# Altium project MCD.PrjPcb
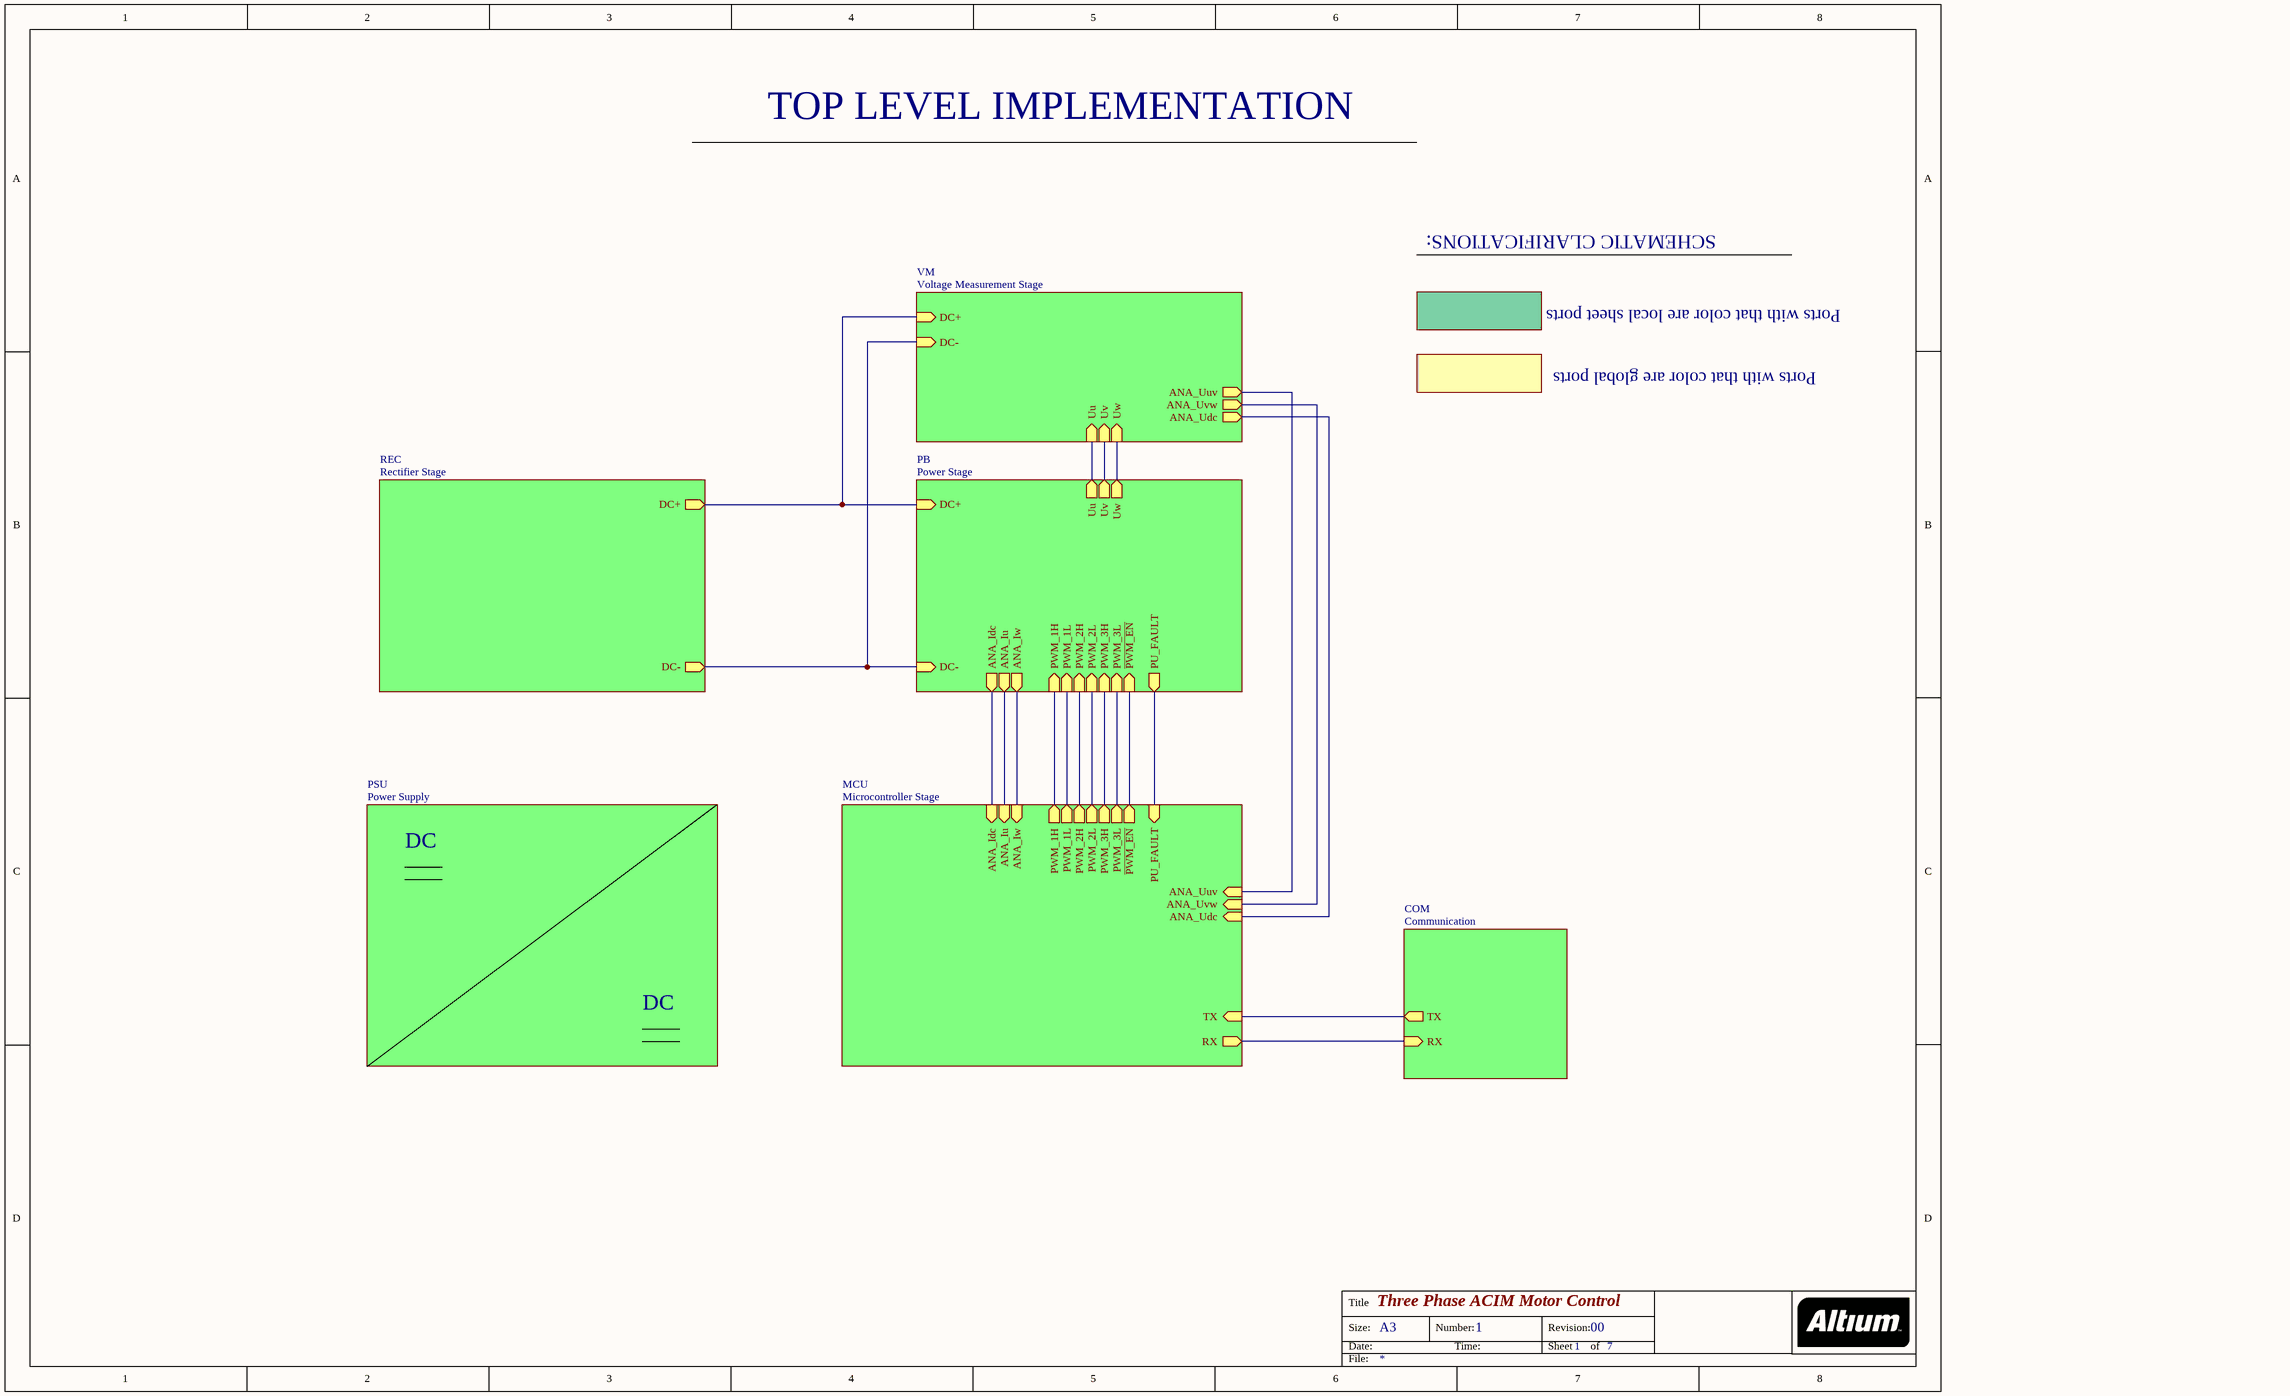
[diagram p0: Main.SchDoc]
7 sheets, 261 parts. Net scope: hierarchical (ports join the sheet entries above them; power ports are global).
Board file: MCD V1.00 R.00.PcbDoc
Sheets:
  Main.SchDoc
    PB = Power Stage.SchDoc
    MCU = Microcontroller Stage.SchDoc
    REC = Rectifier Stage.SchDoc
    VM = Voltage Measurement Stage.SchDoc
    COM = Communication.SchDoc
    PSU = Power Supply.SchDoc

## Sheet Main.SchDoc: Three Phase ACIM Motor Control
size A3; Date: 28.08.2010; ApprovedBy: V.Gyurov; CheckedBy: V.Gyurov; Author: V.Gyurov; CompanyName: V.Gyurov; DrawnBy: V.Gyurov; Engineer: V.Gyurov; DocumentNumber: 1; Revision: 00; SheetNumber: 1; SheetTotal: 7; VersionControl_RevNumber: V1.00 R.00; CurrentDate: 28.08.2010; DocumentName: Three Phase ACIM Motor Control; ModifiedDate: 28.08.2010

### Sub-sheets
COM = Communication: TX (out), RX (in)
MCU = Microcontroller Stage: ANA_Idc (in), ANA_Iu (in), ANA_Iw (in), PWM_1H (out), PWM_1L (out), PWM_2H (out), PWM_2L (out), PWM_3H (out), PWM_3L (out), ~{PWM_EN} (out), PU_FAULT (in), ANA_Uuv (in), ANA_Uvw (in), TX (in), RX (out), ANA_Udc (in)
PB = Power Stage: ANA_Idc (out), PWM_1H (in), PWM_1L (in), PWM_2H (in), PWM_2L (in), PWM_3H (in), PWM_3L (in), ~{PWM_EN} (in), PU_FAULT (out), ANA_Iu (out), ANA_Iw (out), Uu (out), Uv (out), Uw (out), DC+ (in), DC- (in)
PSU = Power Supply: no entries
REC = Rectifier Stage: DC+ (out), DC- (out)
VM = Voltage Measurement Stage: Uu (in), Uv (in), Uw (in), ANA_Uuv (out), ANA_Uvw (out), DC+ (in), DC- (in), ANA_Udc (out)

### Nets
NetC401_2: sheet PB/ANA_Iu, sheet MCU/ANA_Iu
NetC408_2: sheet PB/DC+, sheet REC/DC+, sheet VM/DC+
NetC413_2: sheet PB/ANA_Iw, sheet MCU/ANA_Iw
NetC421_2: sheet PB/ANA_Idc, sheet MCU/ANA_Idc
NetC435_2: sheet PB/Uw, sheet VM/Uw
NetC436_2: sheet PB/Uv, sheet VM/Uv
NetC437_2: sheet PB/Uu, sheet VM/Uu
NetC601_2: sheet MCU/ANA_Udc, sheet VM/ANA_Udc
NetC605_2: sheet MCU/ANA_Uuv, sheet VM/ANA_Uuv
NetC609_2: sheet MCU/ANA_Uvw, sheet VM/ANA_Uvw
NetC700_2: sheet PB/DC-, sheet REC/DC-, sheet VM/DC-
NetR303_2: sheet PB/PU_FAULT, sheet MCU/PU_FAULT
NetU100_1: sheet MCU/TX, sheet COM/TX
NetU100_5: sheet MCU/RX, sheet COM/RX
NetU300_3: sheet PB/~{PWM_EN}, sheet MCU/~{PWM_EN}
NetU301_1: sheet PB/PWM_3H, sheet MCU/PWM_3H
NetU301_60: sheet PB/PWM_1L, sheet MCU/PWM_1L
NetU301_61: sheet PB/PWM_1H, sheet MCU/PWM_1H
NetU301_62: sheet PB/PWM_2L, sheet MCU/PWM_2L
NetU301_63: sheet PB/PWM_2H, sheet MCU/PWM_2H
NetU301_64: sheet PB/PWM_3L, sheet MCU/PWM_3L

### Notes on the sheet
- TOP LEVEL IMPLEMENTATION
- SCHEMATIC CLARIFICATIONS:
- Ports with that color are local sheet ports
- Ports with that color are global ports
- DC
- Title
- Size:
- Date:
- A3
- Number:
- Time:
- Revision:
- Sheet
- of
- File:

## Sheet Power Stage.SchDoc: Power Unit Stage
size A3; Date: 28.08.2010; ApprovedBy: V.Gyurov; CheckedBy: V.Gyurov; Author: V.Gyurov; CompanyName: V.Gyurov; DrawnBy: V.Gyurov; Engineer: V.Gyurov; DocumentNumber: 2; Revision: 00; SheetNumber: 2; SheetTotal: 7; VersionControl_RevNumber: V1.00 R.00; CurrentDate: 28.08.2010; DocumentName: Power Unit Stage; ModifiedDate: 28.08.2010
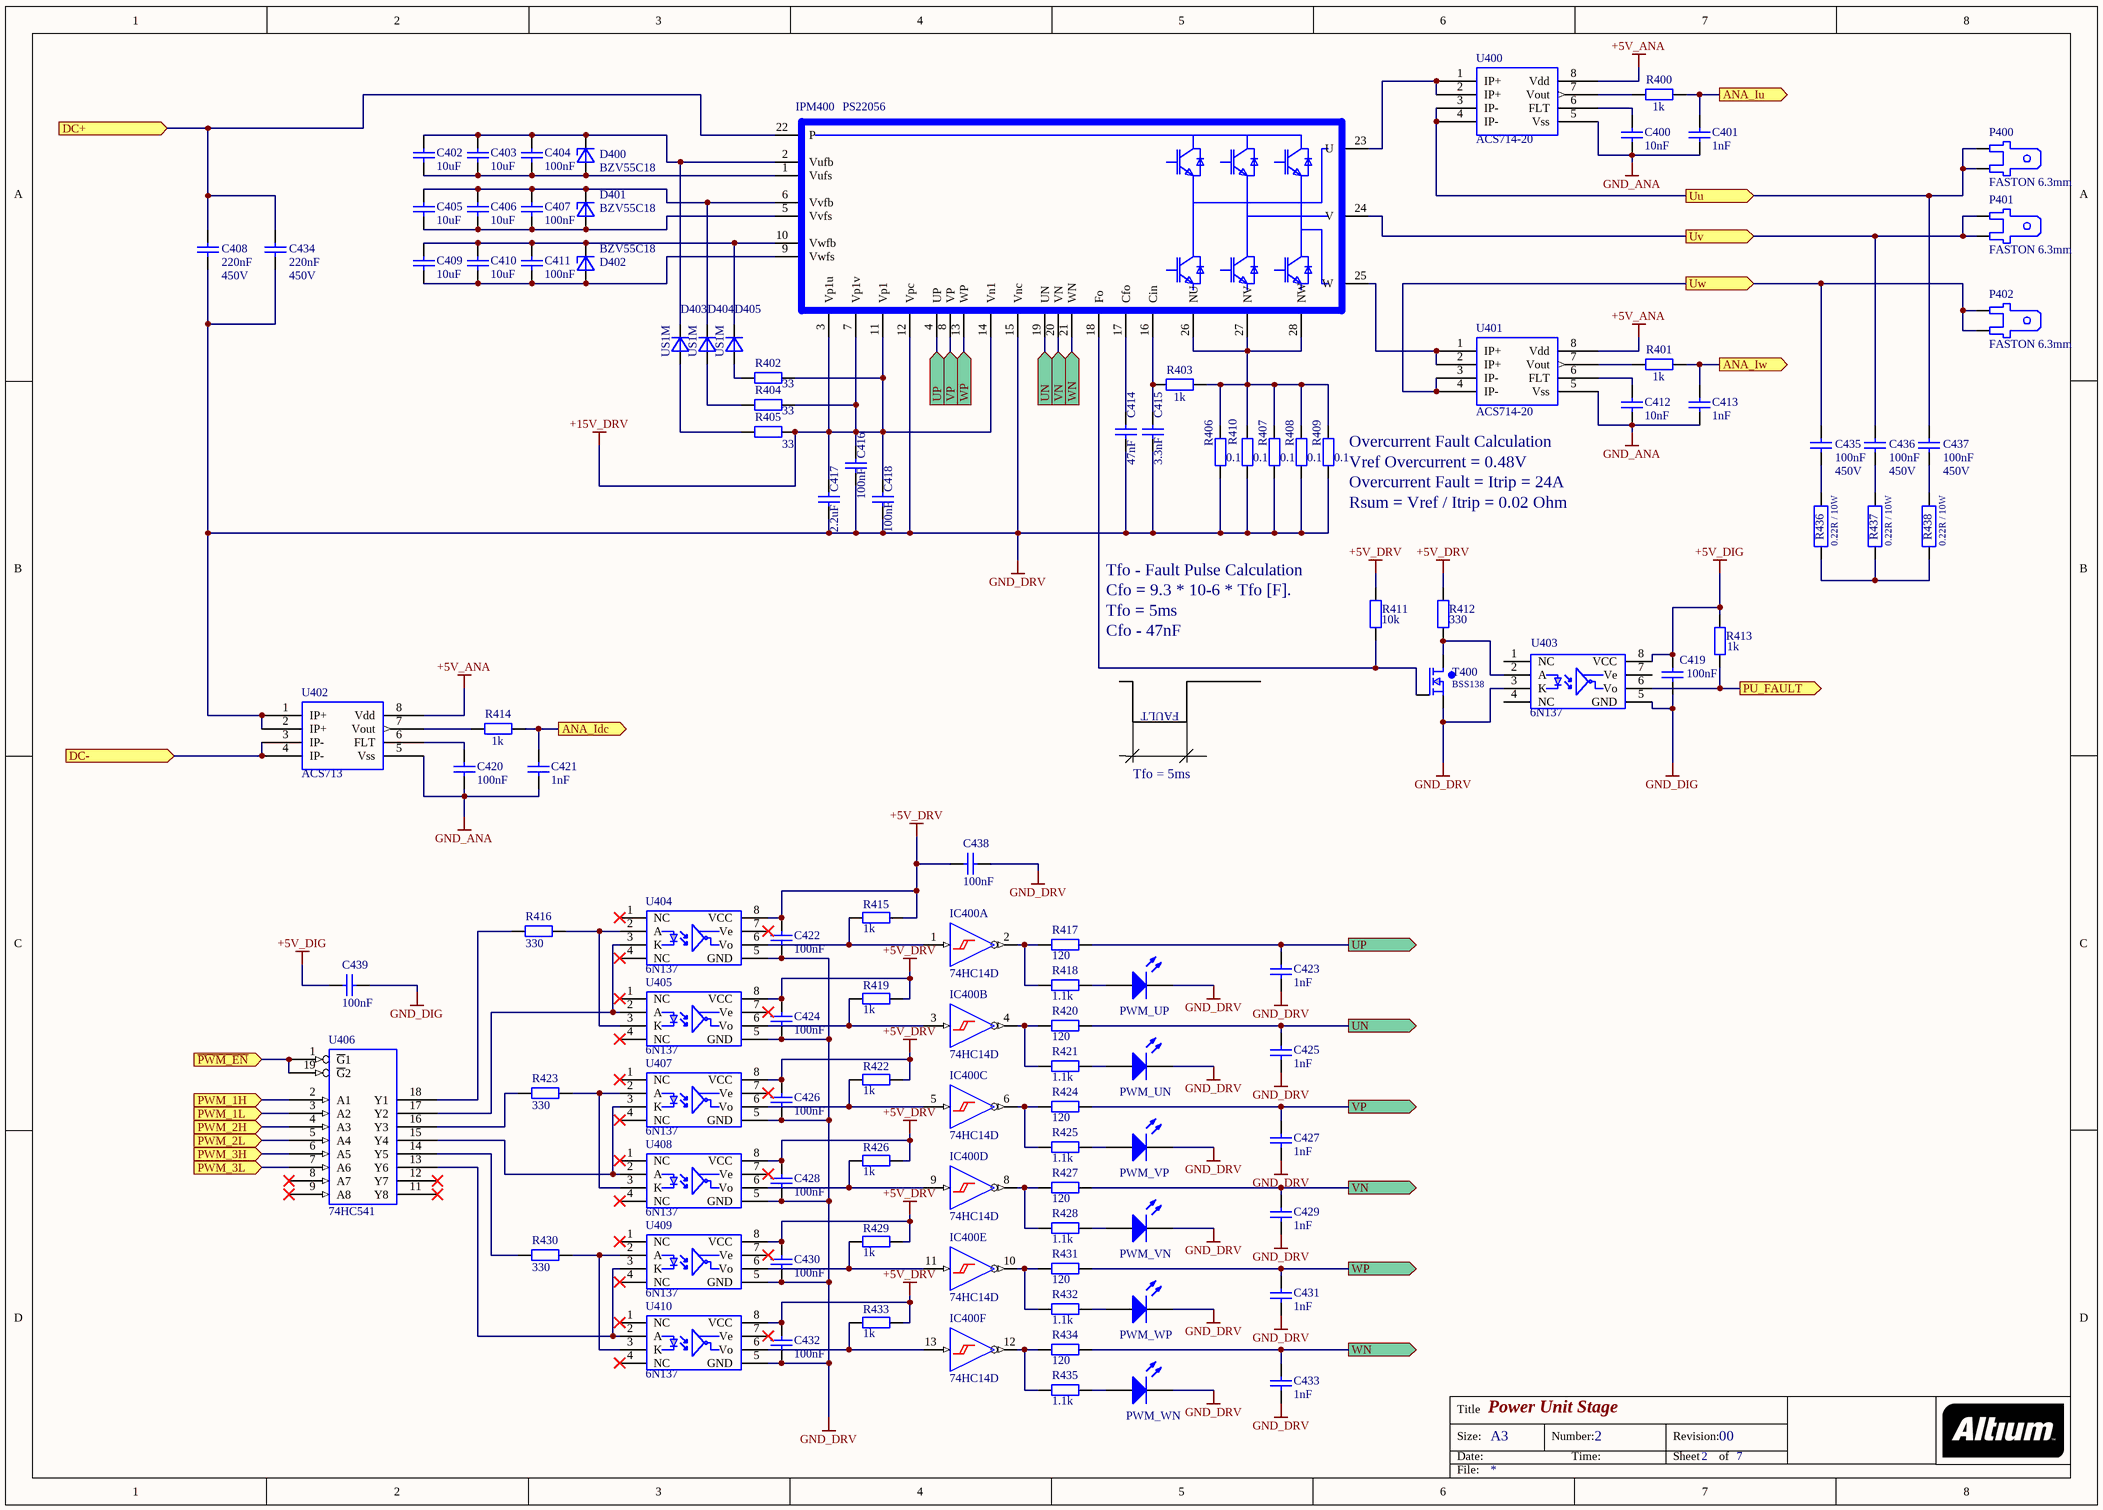
[diagram p1: Power Stage.SchDoc]

### Parts
C400  value 10nF  [1206_REFLOW]  (hidden comment: Cap 1206)
C401  value 1nF  [1206_REFLOW]  (hidden comment: Cap 1206)
C402  value 10uF  [1206_REFLOW]  (hidden comment: Cap 1206)
C403  value 10uF  [1206_REFLOW]  (hidden comment: Cap 1206)
C404  value 100nF  [1206_REFLOW]  (hidden comment: Cap 1206)
C405  value 10uF  [1206_REFLOW]  (hidden comment: Cap 1206)
C406  value 10uF  [1206_REFLOW]  (hidden comment: Cap 1206)
C407  value 100nF  [1206_REFLOW]  (hidden comment: Cap 1206)
C408  value 220nF  Voltage: 450V  [CAP26X19P22_5H]  (hidden comment: Cap)
C409  value 10uF  [1206_REFLOW]  (hidden comment: Cap 1206)
C410  value 10uF  [1206_REFLOW]  (hidden comment: Cap 1206)
C411  value 100nF  [1206_REFLOW]  (hidden comment: Cap 1206)
C412  value 10nF  [1206_REFLOW]  (hidden comment: Cap 1206)
C413  value 1nF  [1206_REFLOW]  (hidden comment: Cap 1206)
C414  value 47nF  [1206_REFLOW]  (hidden comment: Cap 1206)
C415  value 3.3nF  [1206_REFLOW]  (hidden comment: Cap 1206)
C416  value 100nF  [1206_REFLOW]  (hidden comment: Cap 1206)
C417  value 2.2uF  [1206_REFLOW]  (hidden comment: Cap 1206)
C418  value 100nF  [1206_REFLOW]  (hidden comment: Cap 1206)
C419  value 100nF  [1206_REFLOW]  (hidden comment: Cap 1206)
C420  value 100nF  [1206_REFLOW]  (hidden comment: Cap 1206)
C421  value 1nF  [1206_REFLOW]  (hidden comment: Cap 1206)
C422  value 100nF  [1206_REFLOW]  (hidden comment: Cap 1206)
C423  value 1nF  [1206_REFLOW]  (hidden comment: Cap 1206)
C424  value 100nF  [1206_REFLOW]  (hidden comment: Cap 1206)
C425  value 1nF  [1206_REFLOW]  (hidden comment: Cap 1206)
C426  value 100nF  [1206_REFLOW]  (hidden comment: Cap 1206)
C427  value 1nF  [1206_REFLOW]  (hidden comment: Cap 1206)
C428  value 100nF  [1206_REFLOW]  (hidden comment: Cap 1206)
C429  value 1nF  [1206_REFLOW]  (hidden comment: Cap 1206)
C430  value 100nF  [1206_REFLOW]  (hidden comment: Cap 1206)
C431  value 1nF  [1206_REFLOW]  (hidden comment: Cap 1206)
C432  value 100nF  [1206_REFLOW]  (hidden comment: Cap 1206)
C433  value 1nF  [1206_REFLOW]  (hidden comment: Cap 1206)
C434  value 220nF  Voltage: 450V  [CAP26X19P22_5H]  (hidden comment: Cap)
C435  value 100nF  Voltage: 450V  [CAP26X19P22_5H]  (hidden comment: Cap)
C436  value 100nF  Voltage: 450V  [CAP26X19P22_5H]  (hidden comment: Cap)
C437  value 100nF  Voltage: 450V  [CAP26X19P22_5H]  (hidden comment: Cap)
C438  value 100nF  [1206_REFLOW]  (hidden comment: Cap 1206)
C439  value 100nF  [1206_REFLOW]  (hidden comment: Cap 1206)
D400  value BZV55C18  [D_MINIMELF_BZV55C5V1(Primary)]  (hidden comment: BZV55CXXX)
D401  value BZV55C18  [D_MINIMELF_BZV55C5V1(Primary)]  (hidden comment: BZV55CXXX)
D402  value BZV55C18  [D_MINIMELF_BZV55C5V1(Primary)]  (hidden comment: BZV55CXXX)
D403  US1M  [DO-214_S1A(Primary)]
D404  value US1M  [DO-214_S1A(Primary)]  (hidden comment: S1A)
D405  value US1M  [DO-214_S1A(Primary)]  (hidden comment: S1A)
IC400  value 74HC14D  [SO14_HIS]  (hidden comment: SN74HC14D)  (parts A,B,C,D,E,F of 6)
IPM400  value PS22056  [PS22054]  (hidden comment: Component_1)
P400  FASTON 6.3MM  [FASTON 6.3mm]
P401  FASTON 6.3MM  [FASTON 6.3mm]
P402  FASTON 6.3MM  [FASTON 6.3mm]
PWM_UN  LED  [LED_1206]  (value not drawn)
PWM_UP  LED  [LED_1206]  (value not drawn)
PWM_VN  LED  [LED_1206]  (value not drawn)
PWM_VP  LED  [LED_1206]  (value not drawn)
PWM_WN  LED  [LED_1206]  (value not drawn)
PWM_WP  LED  [LED_1206]  (value not drawn)
R400  value 1k  [1206_REFLOW]  (hidden comment: RES)
R401  value 1k  [1206_REFLOW]  (hidden comment: RES)
R402  value 33  [1206_REFLOW]  (hidden comment: RES)
R403  value 1k  [1206_REFLOW]  (hidden comment: RES)
R404  value 33  [1206_REFLOW]  (hidden comment: RES)
R405  value 33  [1206_REFLOW]  (hidden comment: RES)
R406  value 0.1  [1206_REFLOW]  (hidden comment: RES)
R407  value 0.1  [1206_REFLOW]  (hidden comment: RES)
R408  value 0.1  [1206_REFLOW]  (hidden comment: RES)
R409  value 0.1  [1206_REFLOW]  (hidden comment: RES)
R410  value 0.1  [1206_REFLOW]  (hidden comment: RES)
R411  value 10k  [1206_REFLOW]  (hidden comment: RES)
R412  value 330  [1206_REFLOW]  (hidden comment: RES)
R413  value 1k  [1206_REFLOW]  (hidden comment: RES)
R414  value 1k  [1206_REFLOW]  (hidden comment: RES)
R415  value 1k  [1206_REFLOW]  (hidden comment: RES)
R416  value 330  [1206_REFLOW]  (hidden comment: RES)
R417  value 120  [1206_REFLOW]  (hidden comment: RES)
R418  value 1.1k  [1206_REFLOW]  (hidden comment: RES)
R419  value 1k  [1206_REFLOW]  (hidden comment: RES)
R420  value 120  [1206_REFLOW]  (hidden comment: RES)
R421  value 1.1k  [1206_REFLOW]  (hidden comment: RES)
R422  value 1k  [1206_REFLOW]  (hidden comment: RES)
R423  value 330  [1206_REFLOW]  (hidden comment: RES)
R424  value 120  [1206_REFLOW]  (hidden comment: RES)
R425  value 1.1k  [1206_REFLOW]  (hidden comment: RES)
R426  value 1k  [1206_REFLOW]  (hidden comment: RES)
R427  value 120  [1206_REFLOW]  (hidden comment: RES)
R428  value 1.1k  [1206_REFLOW]  (hidden comment: RES)
R429  value 1k  [1206_REFLOW]  (hidden comment: RES)
R430  value 330  [1206_REFLOW]  (hidden comment: RES)
R431  value 120  [1206_REFLOW]  (hidden comment: RES)
R432  value 1.1k  [1206_REFLOW]  (hidden comment: RES)
R433  value 1k  [1206_REFLOW]  (hidden comment: RES)
R434  value 120  [1206_REFLOW]  (hidden comment: RES)
R435  value 1.1k  [1206_REFLOW]  (hidden comment: RES)
R436  value 0.22R / 10W  [RES 10W]  (hidden comment: RES 10W)
R437  value 0.22R / 10W  [RES 10W]  (hidden comment: RES 10W)
R438  value 0.22R / 10W  [RES 10W]  (hidden comment: RES 10W)
T400  value BSS138  [SOT23_HIS_Primary]  (hidden comment: MOSFET N SOT23)
U400  value ACS714-20  [SO8]  (hidden comment: ACS714)
U401  value ACS714-20  [SO8]  (hidden comment: ACS714)
U402  ACS713  [SO8]
U403  6N137  [SO8_HIS]
U404  6N137  [SO8_HIS]
U405  6N137  [SO8_HIS]
U406  74HC541  [SOL20]
U407  6N137  [SO8_HIS]
U408  6N137  [SO8_HIS]
U409  6N137  [SO8_HIS]
U410  6N137  [SO8_HIS]

### Ports
ANA_Idc (out), ANA_Iu (out), ANA_Iw (out), DC+ (in), DC- (in), PU_FAULT (out), PWM_1H (in), PWM_1L (in), PWM_2H (in), PWM_2L (in), PWM_3H (in), PWM_3L (in), UN (in), UN (out), UP (in), UP (out), Uu (out), Uv (out), Uw (out), VN (in), VN (out), VP (in), VP (out), WN (in), WN (out), WP (in), WP (out), ~{PWM_EN} (in)

### Nets
+5V_ANA: U400.8(Vdd) U401.8(Vdd) U402.8(Vdd)
+5V_DIG: C419.2 C439.2 R413.2 U403.8(VCC) U406.20(VCC)
+5V_DRV: C422.2 C424.2 C426.2 C428.2 C430.2 C432.2 C438.2 IC400.14(VCC) R411.2 R412.2 R415.2 R419.2 R422.2 R426.2 R429.2 R433.2 U404.8(VCC) U405.8(VCC) U407.8(VCC) U408.8(VCC) U409.8(VCC) U410.8(VCC)
+15V_DRV: C416.2 C417.2 C418.2 IPM400.3(Vp1u) IPM400.7(Vp1v) IPM400.11(Vp1) IPM400.14(Vn1) R402.2 R404.2 R405.2
GND_ANA: C400.1 C401.1 C412.1 C413.1 C420.1 C421.1 U400.5(Vss) U401.5(Vss) U402.5(Vss)
GND_DIG: C419.1 C439.1 U403.5(GND) U406.10(GND)
GND_DRV: C408.1 C414.1 C415.1 C416.1 C417.1 C418.1 C422.1 C423.1 C424.1 C425.1 C426.1 C427.1 C428.1 C429.1 C430.1 C431.1 C432.1 C433.1 C434.1 C438.1 IC400.7(GND) IPM400.12(Vpc) IPM400.15(Vnc) PWM_UN.K PWM_UP.K PWM_VN.K PWM_VP.K PWM_WN.K PWM_WP.K R406.1 R407.1 R408.1 R409.1 R410.1 T400.2(S) U402.1(IP+) U402.2(IP+) U403.3(K) U404.5(GND) U405.5(GND) U407.5(GND) U408.5(GND) U409.5(GND) U410.5(GND)
NetC400_2: C400.2 U400.6(FLT)
NetC401_2: C401.2 R400.2 ; port ANA_Iu
NetC402_1: C402.1 C403.1 C404.1 D400.A IPM400.1(Vufs)
NetC402_2: C402.2 C403.2 C404.2 D400.K D403.K IPM400.2(Vufb)
NetC405_1: C405.1 C406.1 C407.1 D401.A IPM400.5(Vvfs)
NetC405_2: C405.2 C406.2 C407.2 D401.K D404.K IPM400.6(Vvfb)
NetC408_2: C408.2 C434.2 IPM400.22(P) ; port DC+
NetC409_1: C409.1 C410.1 C411.1 D402.A IPM400.9(Vwfs)
NetC409_2: C409.2 C410.2 C411.2 D402.K D405.K IPM400.10(Vwfb)
NetC412_2: C412.2 U401.6(FLT)
NetC413_2: C413.2 R401.2 ; port ANA_Iw
NetC414_2: C414.2 IPM400.17(Cfo)
NetC415_2: C415.2 IPM400.16(Cin) R403.1
NetC420_2: C420.2 U402.6(FLT)
NetC421_2: C421.2 R414.2 ; port ANA_Idc
NetC423_2: C423.2 IPM400.4(UP) R417.2 ; port UP
NetC425_2: C425.2 IPM400.19(UN) R420.2 ; port UN
NetC427_2: C427.2 IPM400.8(VP) R424.2 ; port VP
NetC429_2: C429.2 IPM400.20(VN) R427.2 ; port VN
NetC431_2: C431.2 IPM400.13(WP) R431.2 ; port WP
NetC433_2: C433.2 IPM400.21(WN) R434.2 ; port WN
NetC435_1: C435.1 R436.1
NetC435_2: C435.2 P402.1 P402.2 U401.3(IP-) U401.4(IP-) ; port Uw
NetC436_1: C436.1 R437.1
NetC436_2: C436.2 IPM400.24(V) P401.1 P401.2 ; port Uv
NetC437_1: C437.1 R438.1
NetC437_2: C437.2 P400.1 P400.2 U400.3(IP-) U400.4(IP-) ; port Uu
NetC700_2: U402.3(IP-) U402.4(IP-) ; port DC-
NetD403_A: D403.A R405.1
NetD404_A: D404.A R404.1
NetD405_A: D405.A R402.1
NetIC400_1: IC400.1(A) R415.1 U404.6(Vo)
NetIC400_2: IC400.2(Y) R417.1 R418.1
NetIC400_3: IC400.3(A) R419.1 U405.6(Vo)
NetIC400_4: IC400.4(Y) R420.1 R421.1
NetIC400_5: IC400.5(A) R422.1 U407.6(Vo)
NetIC400_6: IC400.6(Y) R424.1 R425.1
NetIC400_8: IC400.8(Y) R427.1 R428.1
NetIC400_9: IC400.9(A) R426.1 U408.6(Vo)
NetIC400_10: IC400.10(Y) R431.1 R432.1
NetIC400_11: IC400.11(A) R429.1 U409.6(Vo)
NetIC400_12: IC400.12(Y) R434.1 R435.1
NetIC400_13: IC400.13(A) R433.1 U410.6(Vo)
NetIPM400_18: IPM400.18(Fo) R411.1 T400.1(G)
NetIPM400_23: IPM400.23(U) U400.1(IP+) U400.2(IP+)
NetIPM400_25: IPM400.25(W) U401.1(IP+) U401.2(IP+)
NetIPM400_26: IPM400.26(NU) IPM400.27(NV) IPM400.28(NW) R403.2 R406.2 R407.2 R408.2 R409.2 R410.2
NetPWM_UN_A: PWM_UN.A R421.2
NetPWM_UP_A: PWM_UP.A R418.2
NetPWM_VN_A: PWM_VN.A R428.2
NetPWM_VP_A: PWM_VP.A R425.2
NetPWM_WN_A: PWM_WN.A R435.2
NetPWM_WP_A: PWM_WP.A R432.2
NetR303_2: R413.1 U403.6(Vo) ; port PU_FAULT
NetR400_1: R400.1 U400.7(Vout)
NetR401_1: R401.1 U401.7(Vout)
NetR412_1: R412.1 T400.3(D) U403.2(A)
NetR414_1: R414.1 U402.7(Vout)
NetR416_1: R416.1 U406.18(Y1)
NetR416_2: R416.2 U404.2(A) U405.3(K)
NetR423_1: R423.1 U406.16(Y3)
NetR423_2: R423.2 U407.2(A) U408.3(K)
NetR430_1: R430.1 U406.14(Y5)
NetR430_2: R430.2 U409.2(A) U410.3(K)
NetR436_2: R436.2 R437.2 R438.2
NetU300_3: U406.1(~{G}1) U406.19(~{G}2) ; port ~{PWM_EN}
NetU301_1: U406.6(A5) ; port PWM_3H
NetU301_60: U406.3(A2) ; port PWM_1L
NetU301_61: U406.2(A1) ; port PWM_1H
NetU301_62: U406.5(A4) ; port PWM_2L
NetU301_63: U406.4(A3) ; port PWM_2H
NetU301_64: U406.7(A6) ; port PWM_3L
NetU404_3: U404.3(K) U405.2(A) U406.17(Y2)
NetU406_13: U406.13(Y6) U409.3(K) U410.2(A)
NetU406_15: U406.15(Y4) U407.3(K) U408.2(A)

Not connected (* = marked no-connect by the designer): U403 1(NC) 4(NC) 7(Ve); U404 1(NC)* 4(NC)* 7(Ve)*; U405 1(NC)* 4(NC)* 7(Ve)*; U406 8(A7)* 9(A8)* 11(Y8)* 12(Y7)*; U407 1(NC)* 4(NC)* 7(Ve)*; U408 1(NC)* 4(NC)* 7(Ve)*; U409 1(NC)* 4(NC)* 7(Ve)*; U410 1(NC)* 4(NC)* 7(Ve)*

### Notes on the sheet
- (near R409) Overcurrent Fault Calculation
- (near R409) Overcurrent Fault = Itrip = 24A
- (near R409) Vref Overcurrent = 0.48V
- Rsum = Vref / Itrip = 0.02 Ohm
- (near R411) Tfo - Fault Pulse Calculation
- (near R411) Cfo = 9.3 * 10-6 * Tfo [F].
- Tfo = 5ms
- Cfo - 47nF
- FAULT
- Title
- Size:
- Date:
- A3
- Number:
- Time:
- Revision:
- Sheet
- of
- File:

### Library data of the parts
D400-D402 = BZV55CXXX: Zener Diode
D403 = S1A: Value: US1M
IC400 = SN74HC14D: Hex Schmitt-Trigger INVERTERS; Group: IC; Subgroup: Logic; Subgroup1: Gate; Package: SO14; Mounting: SMD
IPM400 = Component_1: Description: IPM Module
PWM_UN PWM_UP PWM_VN PWM_VP PWM_WN PWM_WP = LED: Value: TBD
R400-R435 = RES 1
U403-U405 U407-U410 = 6N137: Single Optocoupler; Manufacturer: Agilent; Value: 6N137
P400-P402 = FASTON 6.3MM: Value: FASTON 6.3mm
U402 = ACS713: Value: ACS713
U406 = 74HC541: Value: 74HC541

## Sheet Microcontroller Stage.SchDoc: Microcontroller Stage
size A3; Date: 28.04.2010; ApprovedBy: V.Gyurov; CheckedBy: V.Gyurov; Author: V.Gyurov; CompanyName: V.Gyurov; DrawnBy: V.Gyurov; Engineer: V.Gyurov; Organization: none; DocumentNumber: 5; Revision: 00; SheetNumber: 5; SheetTotal: 7; VersionControl_RevNumber: V1.00 R.00; IsUserConfigurable: none; CurrentDate: 28.04.2010; DocumentName: Microcontroller Stage; ModifiedDate: 28.04.2010
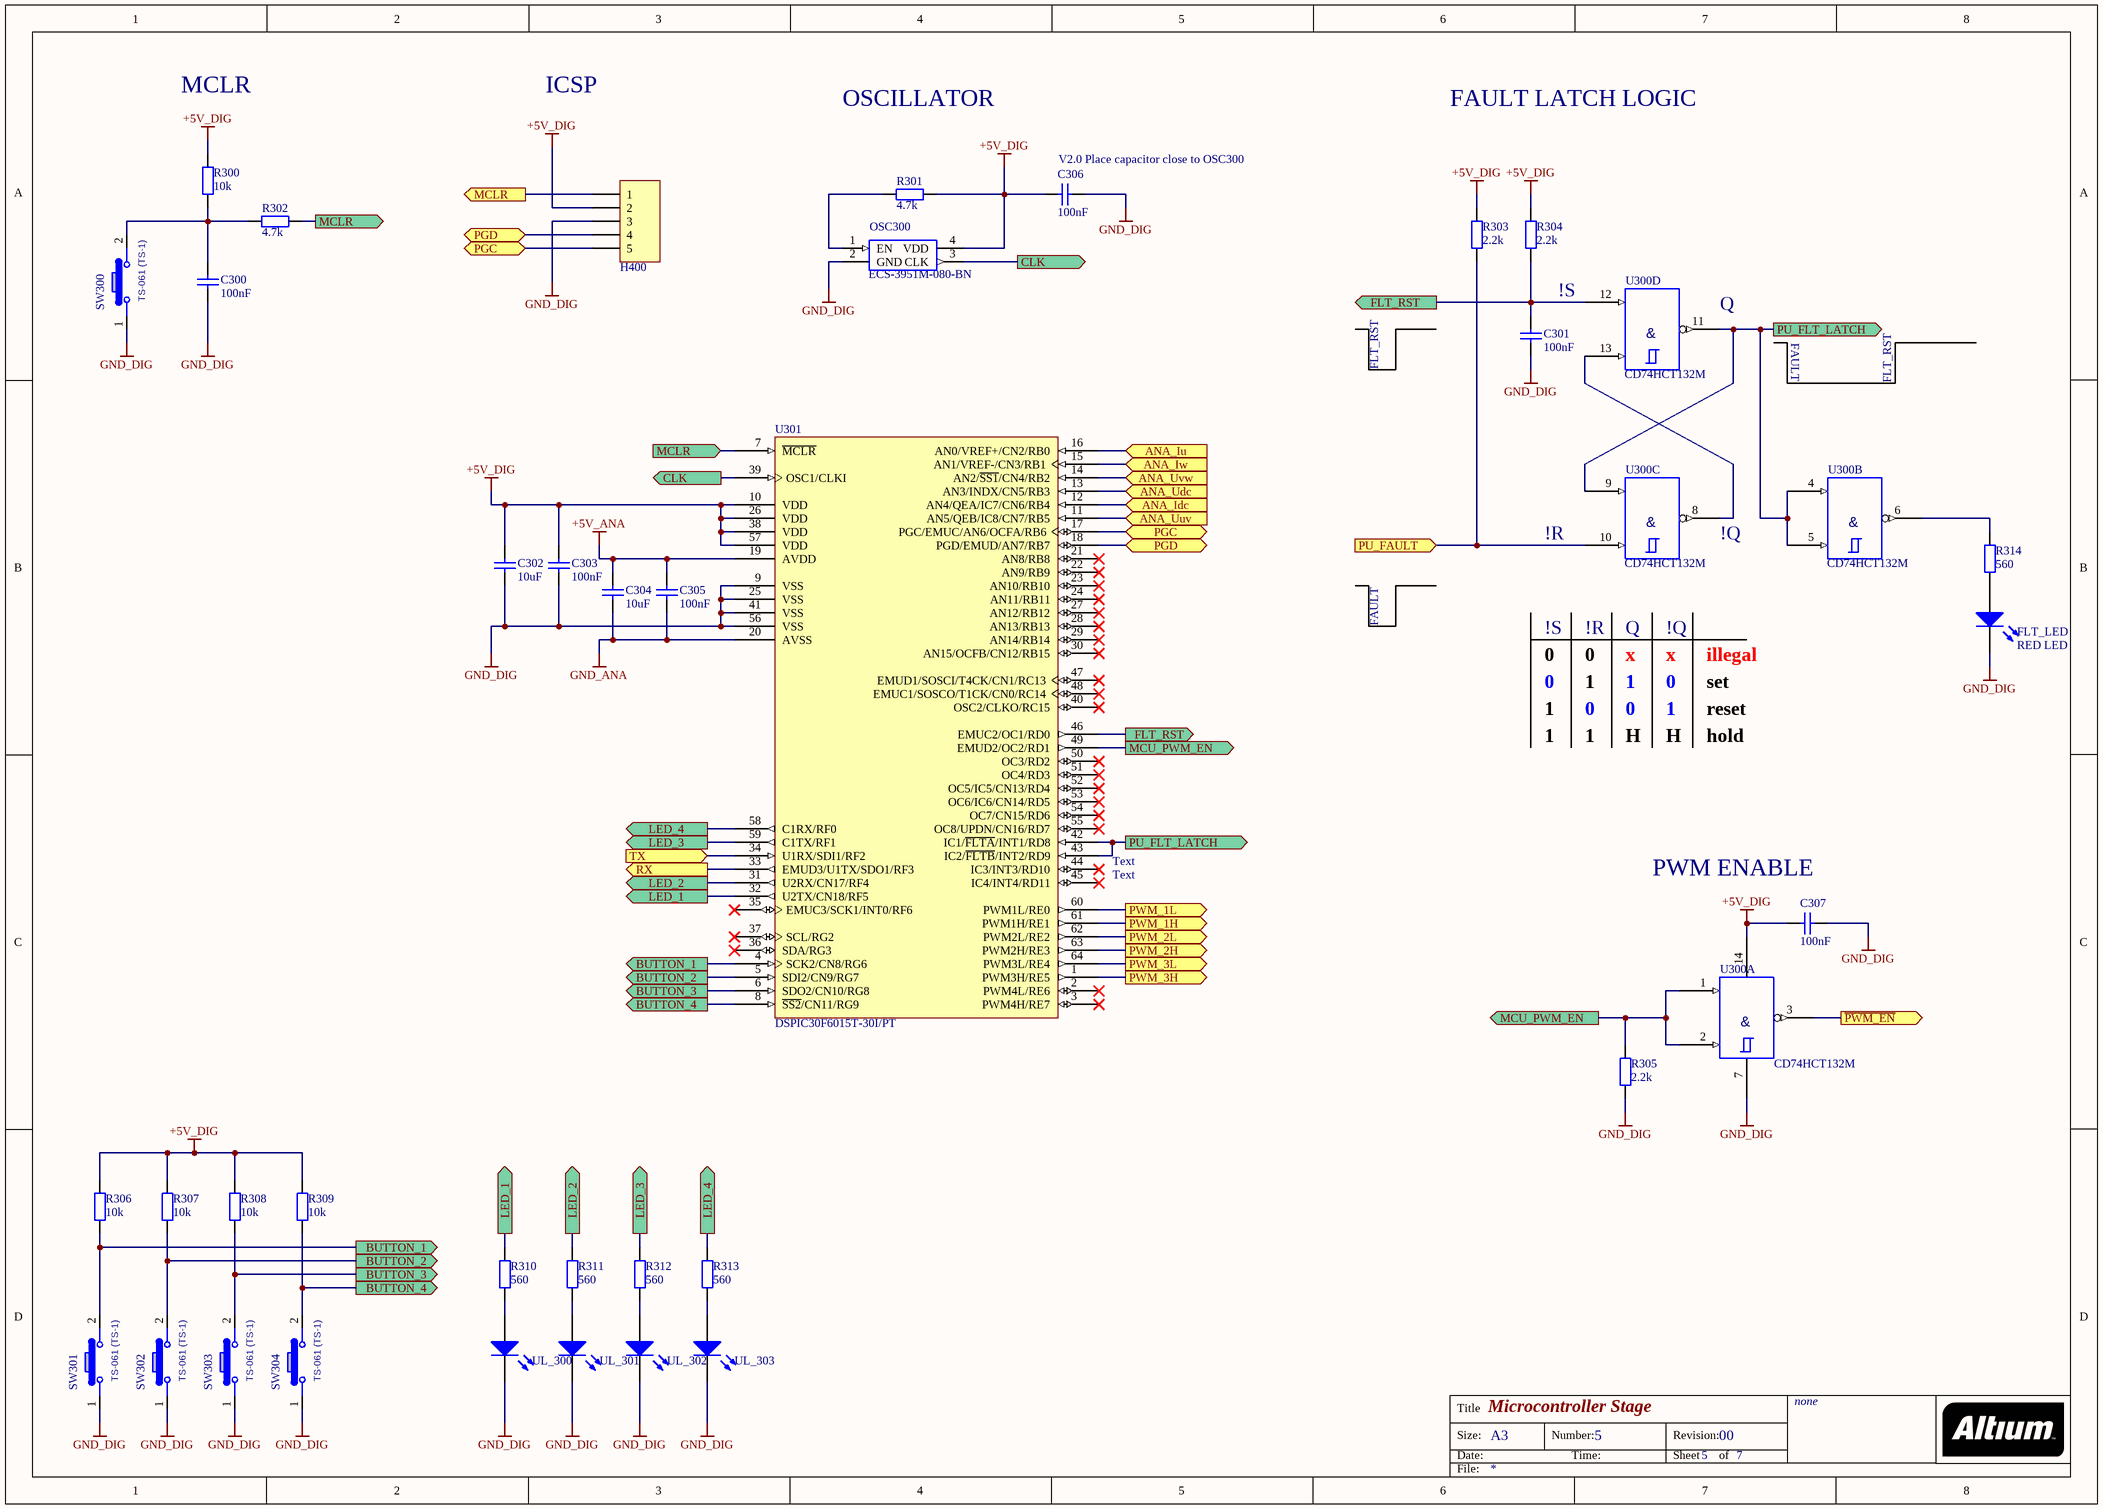
[diagram p2: Microcontroller Stage.SchDoc]

### Parts
C300  value 100nF  [1206_REFLOW]  (hidden comment: Cap 1206)
C301  value 100nF  [1206_REFLOW]  (hidden comment: Cap 1206)
C302  value 10uF  [1206_REFLOW]  (hidden comment: Cap 1206)
C303  value 100nF  [1206_REFLOW]  (hidden comment: Cap 1206)
C304  value 10uF  [1206_REFLOW]  (hidden comment: Cap 1206)
C305  value 100nF  [1206_REFLOW]  (hidden comment: Cap 1206)
C306  value 100nF  [1206_REFLOW]  (hidden comment: Cap 1206)
C307  value 100nF  [1206_REFLOW]  (hidden comment: Cap 1206)
FLT_LED  RED LED  [LED_1206]
H400  HEADER X5  [SIP5]  (value not drawn)
OSC300  value ECS-3951M-080-BN  [OSC7X5]  (hidden comment: ESC-3951M-80-BN)
R300  value 10k  [1206_REFLOW]  (hidden comment: RES)
R301  value 4.7k  [1206_REFLOW]  (hidden comment: RES)
R302  value 4.7k  [1206_REFLOW]  (hidden comment: RES)
R303  value 2.2k  [1206_REFLOW]  (hidden comment: RES)
R304  value 2.2k  [1206_REFLOW]  (hidden comment: RES)
R305  value 2.2k  [1206_REFLOW]  (hidden comment: RES)
R306  value 10k  [1206_REFLOW]  (hidden comment: RES)
R307  value 10k  [1206_REFLOW]  (hidden comment: RES)
R308  value 10k  [1206_REFLOW]  (hidden comment: RES)
R309  value 10k  [1206_REFLOW]  (hidden comment: RES)
R310  value 560  [1206_REFLOW]  (hidden comment: RES)
R311  value 560  [1206_REFLOW]  (hidden comment: RES)
R312  value 560  [1206_REFLOW]  (hidden comment: RES)
R313  value 560  [1206_REFLOW]  (hidden comment: RES)
R314  value 560  [1206_REFLOW]  (hidden comment: RES)
SW300  TS-061 (TS-1)  [BUTTON]
SW301  TS-061 (TS-1)  [BUTTON]
SW302  TS-061 (TS-1)  [BUTTON]
SW303  TS-061 (TS-1)  [BUTTON]
SW304  TS-061 (TS-1)  [BUTTON]
U300  CD74HCT132M  [SO14]  (parts A,B,C,D of 4)
U301  DSPIC30F6015T-30I/PT  [TQFP-PT64_N]
UL_300  YELLOW LED  [LED_1206]  (value not drawn)
UL_301  YELLOW LED  [LED_1206]  (value not drawn)
UL_302  YELLOW LED  [LED_1206]  (value not drawn)
UL_303  YELLOW LED  [LED_1206]  (value not drawn)

### Ports
ANA_Idc (in), ANA_Iu (in), ANA_Iw (in), ANA_Udc (in), ANA_Uuv (in), ANA_Uvw (in), BUTTON_1 (out), BUTTON_2 (out), BUTTON_3 (out), BUTTON_4 (out), CLK (out), FLT_RST (out), LED_1 (out), LED_2 (out), LED_3 (out), LED_4 (out), MCLR (in), MCLR (out), MCU_PWM_EN (out), PGC (bidir), PGD (bidir), PU_FAULT (in), PU_FLT_LATCH (out), PWM_1H (out), PWM_1L (out), PWM_2H (out), PWM_2L (out), PWM_3H (out), PWM_3L (out), RX (out), TX (in), ~{PWM_EN} (out)

### Nets
+5V_ANA: C304.2 C305.2 U301.19(AVDD)
+5V_DIG: C302.2 C303.2 C306.1 C307.2 H400.2 OSC300.4(VDD) R300.1 R301.1 R303.1 R304.1 R306.1 R307.1 R308.1 R309.1 U300.14(Vcc) U301.10(VDD) U301.26(VDD) U301.38(VDD) U301.57(VDD)
GND_ANA: C304.1 C305.1 U301.20(AVSS)
GND_DIG: C300.1 C301.1 C302.1 C303.1 C306.2 C307.1 FLT_LED.K H400.3 OSC300.2(GND) R305.2 SW300.1 SW301.1 SW302.1 SW303.1 SW304.1 U300.7(GND) U301.9(VSS) U301.25(VSS) U301.41(VSS) U301.56(VSS) UL_300.K UL_301.K UL_302.K UL_303.K
NetC300_2: C300.2 R300.2 R302.1 SW300.2
NetC301_2: C301.2 R304.2 U300.12(4A) U301.46(EMUC2/OC1/RD0) ; port FLT_RST
NetC401_2: U301.16(AN0/VREF+/CN2/RB0) ; port ANA_Iu
NetC413_2: U301.15(AN1/VREF-/CN3/RB1) ; port ANA_Iw
NetC421_2: U301.12(AN4/QEA/IC7/CN6/RB4) ; port ANA_Idc
NetC601_2: U301.13(AN3/INDX/CN5/RB3) ; port ANA_Udc
NetC605_2: U301.11(AN5/QEB/IC8/CN7/RB5) ; port ANA_Uuv
NetC609_2: U301.14(AN2/~{SS1}/CN4/RB2) ; port ANA_Uvw
NetFLT_LED_A: FLT_LED.A R314.1
NetH400_1: H400.1 R302.2 U301.7(~{MCLR}) ; port MCLR
NetH400_4: H400.4 U301.18(PGD/EMUD/AN7/RB7) ; port PGD
NetH400_5: H400.5 U301.17(PGC/EMUC/AN6/OCFA/RB6) ; port PGC
NetOSC300_1: OSC300.1(EN) R301.2
NetOSC300_3: OSC300.3(CLK) U301.39(OSC1/CLKI) ; port CLK
NetR303_2: R303.2 U300.10(3B) ; port PU_FAULT
NetR305_1: R305.1 U300.1(1A) U300.2(1B) U301.49(EMUD2/OC2/RD1) ; port MCU_PWM_EN
NetR306_2: R306.2 SW301.2 U301.4(SCK2/CN8/RG6) ; port BUTTON_1
NetR307_2: R307.2 SW302.2 U301.5(SDI2/CN9/RG7) ; port BUTTON_2
NetR308_2: R308.2 SW303.2 U301.6(SDO2/CN10/RG8) ; port BUTTON_3
NetR309_2: R309.2 SW304.2 U301.8(~{SS2}/CN11/RG9) ; port BUTTON_4
NetR310_1: R310.1 UL_300.A
NetR310_2: R310.2 U301.32(U2TX/CN18/RF5) ; port LED_1
NetR311_1: R311.1 UL_301.A
NetR311_2: R311.2 U301.31(U2RX/CN17/RF4) ; port LED_2
NetR312_1: R312.1 UL_302.A
NetR312_2: R312.2 U301.59(C1TX/RF1) ; port LED_3
NetR313_1: R313.1 UL_303.A
NetR313_2: R313.2 U301.58(C1RX/RF0) ; port LED_4
NetR314_2: R314.2 U300.6(~{2Y})
NetU100_1: U301.34(U1RX/SDI1/RF2) ; port TX
NetU100_5: U301.33(EMUD3/U1TX/SDO1/RF3) ; port RX
NetU300_3: U300.3(~{1Y}) ; port ~{PWM_EN}
NetU300_4: U300.4(2A) U300.5(2B) U300.9(3A) U300.11(~{4Y}) U301.42(IC1/~{FLTA}/INT1/RD8) U301.43(IC2/~{FLTB}/INT2/RD9) ; port PU_FLT_LATCH
NetU300_8: U300.8(~{3Y}) U300.13(4B)
NetU301_1: U301.1(PWM3H/RE5) ; port PWM_3H
NetU301_60: U301.60(PWM1L/RE0) ; port PWM_1L
NetU301_61: U301.61(PWM1H/RE1) ; port PWM_1H
NetU301_62: U301.62(PWM2L/RE2) ; port PWM_2L
NetU301_63: U301.63(PWM2H/RE3) ; port PWM_2H
NetU301_64: U301.64(PWM3L/RE4) ; port PWM_3L

Not connected (* = marked no-connect by the designer): SW300 3 4; SW301 3 4; SW302 3 4; SW303 3 4; SW304 3 4; U301 2(PWM4L/RE6)* 3(PWM4H/RE7)* 21(AN8/RB8)* 22(AN9/RB9)* 23(AN10/RB10)* 24(AN11/RB11)* 27(AN12/RB12)* 28(AN13/RB13)* 29(AN14/RB14)* 30(AN15/OCFB/CN12/RB15)* 35(EMUC3/SCK1/INT0/RF6)* 36(SDA/RG3)* 37(SCL/RG2)* 40(OSC2/CLKO/RC15)* 44(IC3/INT3/RD10)* 45(IC4/INT4/RD11)* 47(EMUD1/SOSCI/T4CK/CN1/RC13)* 48(EMUC1/SOSCO/T1CK/CN0/RC14)* 50(OC3/RD2)* 51(OC4/RD3)* 52(OC5/IC5/CN13/RD4)* 53(OC6/IC6/CN14/RD5)* 54(OC7/CN15/RD6)* 55(OC8/UPDN/CN16/RD7)*

### Notes on the sheet
- MCLR
- ICSP
- OSCILLATOR
- FAULT LATCH LOGIC
- (near C306) V2.0 Place capacitor close to OSC300
- !S
- (near U300) Q
- FLT_RST
- FAULT
- !R
- (near U300) !Q
- Q
- !Q
- 0
- 1
- x
- set
- reset
- illegal
- H
- hold
- Text
- (near C307) PWM ENABLE
- Title
- Size:
- Date:
- A3
- Number:
- Time:
- Revision:
- Sheet
- of
- File:
- (in symbol CD74HCT132M, part A) &
- (in symbol CD74HCT132M, part B) &
- (in symbol CD74HCT132M, part C) &
- (in symbol CD74HCT132M, part D) &

### Library data of the parts
FLT_LED UL_300-UL_303 = LED: Value: TBD
OSC300 = ESC-3951M-80-BN: ESC-3951M-80-BN 8Mhz; Mfrr: ECS Inc; Mfrr Part No.: ECS-3951M-080-BN-TR; Order Code: XC295CT-ND; Group: IC; Subgroup: Oscillator; Supplier: Digi-Key
R300-R314 = RES 1
SW300-SW304 = TS-061 (TS-1): BUTTON; Value: TS-061 (TS-1)
U300 = CD74HCT132M: Manufacturer 1: Texas Instruments; PN: 01010108-0013-0000; Group: Logic ICs; Detail: QUADRUPLE POSITIVE-NAND GATES WITH SCHMITT-TRIGGER INPUTS; Case: SO-14; Mfr 1 PN: CD74HCT132M; Manufacturer 2: *; Mfr 2 PN: *; ModifyDate: 06/06/2008 17:02:07; Value: CD74HCT132M
U301 = DSPIC30F6015T-30I/PT: High-Performance 16-bit Digital Signal Controller, 144 KB Flash, 8 KB SRAM, 4 KB EEPROM, 64-Pin TQFP, Industrial Temperature, Tape and Reel; Published: 29-Jan-2009; DatasheetVersion: revD, Jun-2008; PackageVersion: revAW, Oct-2008; PackageReference: TQFP-PT64; Publisher: Altium Limited; PackageDescription: 64-Lead Thin Plastic Quad Flat Pack (PT) - 10x10x1mm Body, 2.00mm [TQFP]; Code_JEDEC: MS-026; ComponentLink1Description: Manufacturer Link; ComponentLink1URL: http://www.microchip.com; ComponentLink2Description: Datasheet; ComponentLink2URL: http://ww1.microchip.com/downloads/en/DeviceDoc/70150D.pdf; ComponentLink3Description: Packaging Specification; ComponentLink3URL: http://ww1.microchip.com/downloads/en/PackagingSpec/00049AW.pdf
H400 = HEADER X5: Value: HEADER X5

## Sheet Rectifier Stage.SchDoc: Rectifier Stage
size A4; Date: 28.08.2010; ApprovedBy: V.Gyurov; CheckedBy: V.Gyurov; Author: V.Gyurov; CompanyName: V.Gyurov; DrawnBy: V.Gyurov; Engineer: V.Gyurov; DocumentNumber: 7; Revision: 00; SheetNumber: 7; SheetTotal: 7; VersionControl_RevNumber: V1.00 R.00; CurrentDate: 28.08.2010; DocumentName: Rectifier Stage
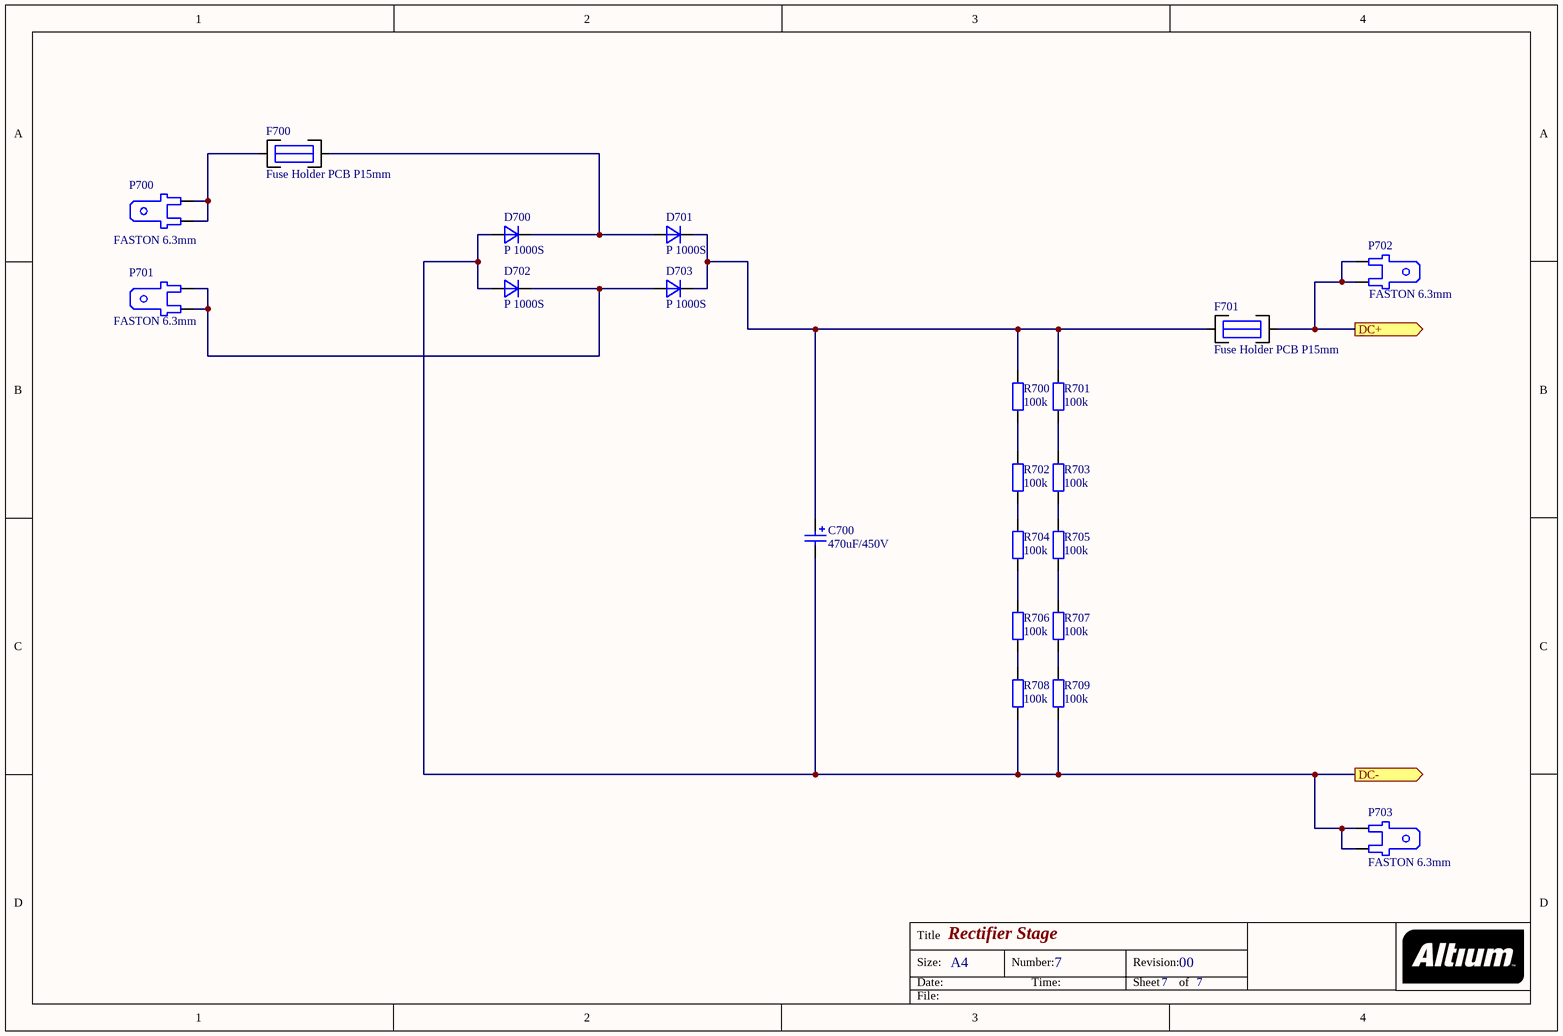
[diagram p3: Rectifier Stage.SchDoc]

### Parts
C700  value 470uF/450V  [CAPR 52X35]  (hidden comment: Cap)
D700  P 1000S  [P 1000 S]
D701  P 1000S  [P 1000 S]
D702  P 1000S  [P 1000 S]
D703  P 1000S  [P 1000 S]
F700  Fuse Holder PCB P15mm  [Fuse Holder PCB P15mm]
F701  Fuse Holder PCB P15mm  [Fuse Holder PCB P15mm]
P700  FASTON 6.3MM  [FASTON 6.3mm]
P701  FASTON 6.3MM  [FASTON 6.3mm]
P702  FASTON 6.3MM  [FASTON 6.3mm]
P703  FASTON 6.3MM  [FASTON 6.3mm]
R700  value 100k  [1206_REFLOW]  (hidden comment: RES)
R701  value 100k  [1206_REFLOW]  (hidden comment: RES)
R702  value 100k  [1206_REFLOW]  (hidden comment: RES)
R703  value 100k  [1206_REFLOW]  (hidden comment: RES)
R704  value 100k  [1206_REFLOW]  (hidden comment: RES)
R705  value 100k  [1206_REFLOW]  (hidden comment: RES)
R706  value 100k  [1206_REFLOW]  (hidden comment: RES)
R707  value 100k  [1206_REFLOW]  (hidden comment: RES)
R708  value 100k  [1206_REFLOW]  (hidden comment: RES)
R709  value 100k  [1206_REFLOW]  (hidden comment: RES)

### Ports
DC+ (out), DC- (out)

### Nets
NetC408_2: F701.2 P702.1 P702.2 ; port DC+
NetC700_1: C700.1 D701.K D703.K F701.1 R700.1 R701.1
NetC700_2: C700.2 D700.A D702.A P703.1 P703.2 R708.2 R709.2 ; port DC-
NetD700_K: D700.K D701.A F700.2
NetD702_K: D702.K D703.A P701.1 P701.2
NetF700_1: F700.1 P700.1 P700.2
NetR700_2: R700.2 R702.1
NetR701_2: R701.2 R703.1
NetR702_2: R702.2 R704.1
NetR703_2: R703.2 R705.1
NetR704_2: R704.2 R706.1
NetR705_2: R705.2 R707.1
NetR706_2: R706.2 R708.1
NetR707_2: R707.2 R709.1

### Notes on the sheet
- Title
- Size:
- Date:
- A4
- Number:
- Time:
- Revision:
- Sheet
- of
- File:

### Library data of the parts
C700 = Cap pol
D700-D703 = P 1000S: Description: Standard silicon rectifier  diode; Value: P 1000S
R700-R709 = RES 1
F700 F701 = Fuse Holder PCB P15mm: Value: Fuse Holder PCB P15mm
P700-P703 = FASTON 6.3MM: Value: FASTON 6.3mm

## Sheet Voltage Measurement Stage.SchDoc: Voltage Measurement Stage
size A3; Date: 28.08.2010; ApprovedBy: V.Gyurov; CheckedBy: V.Gyurov; Author: V.Gyurov; CompanyName: V.Gyurov; DrawnBy: V.Gyurov; Engineer: V.Gyurov; DocumentNumber: 3; Revision: 00; SheetNumber: 3; SheetTotal: 7; VersionControl_RevNumber: V1.00 R.00; CurrentDate: 28.08.2010; DocumentName: Voltage Measurement Stage; ModifiedDate: 28.08.2010
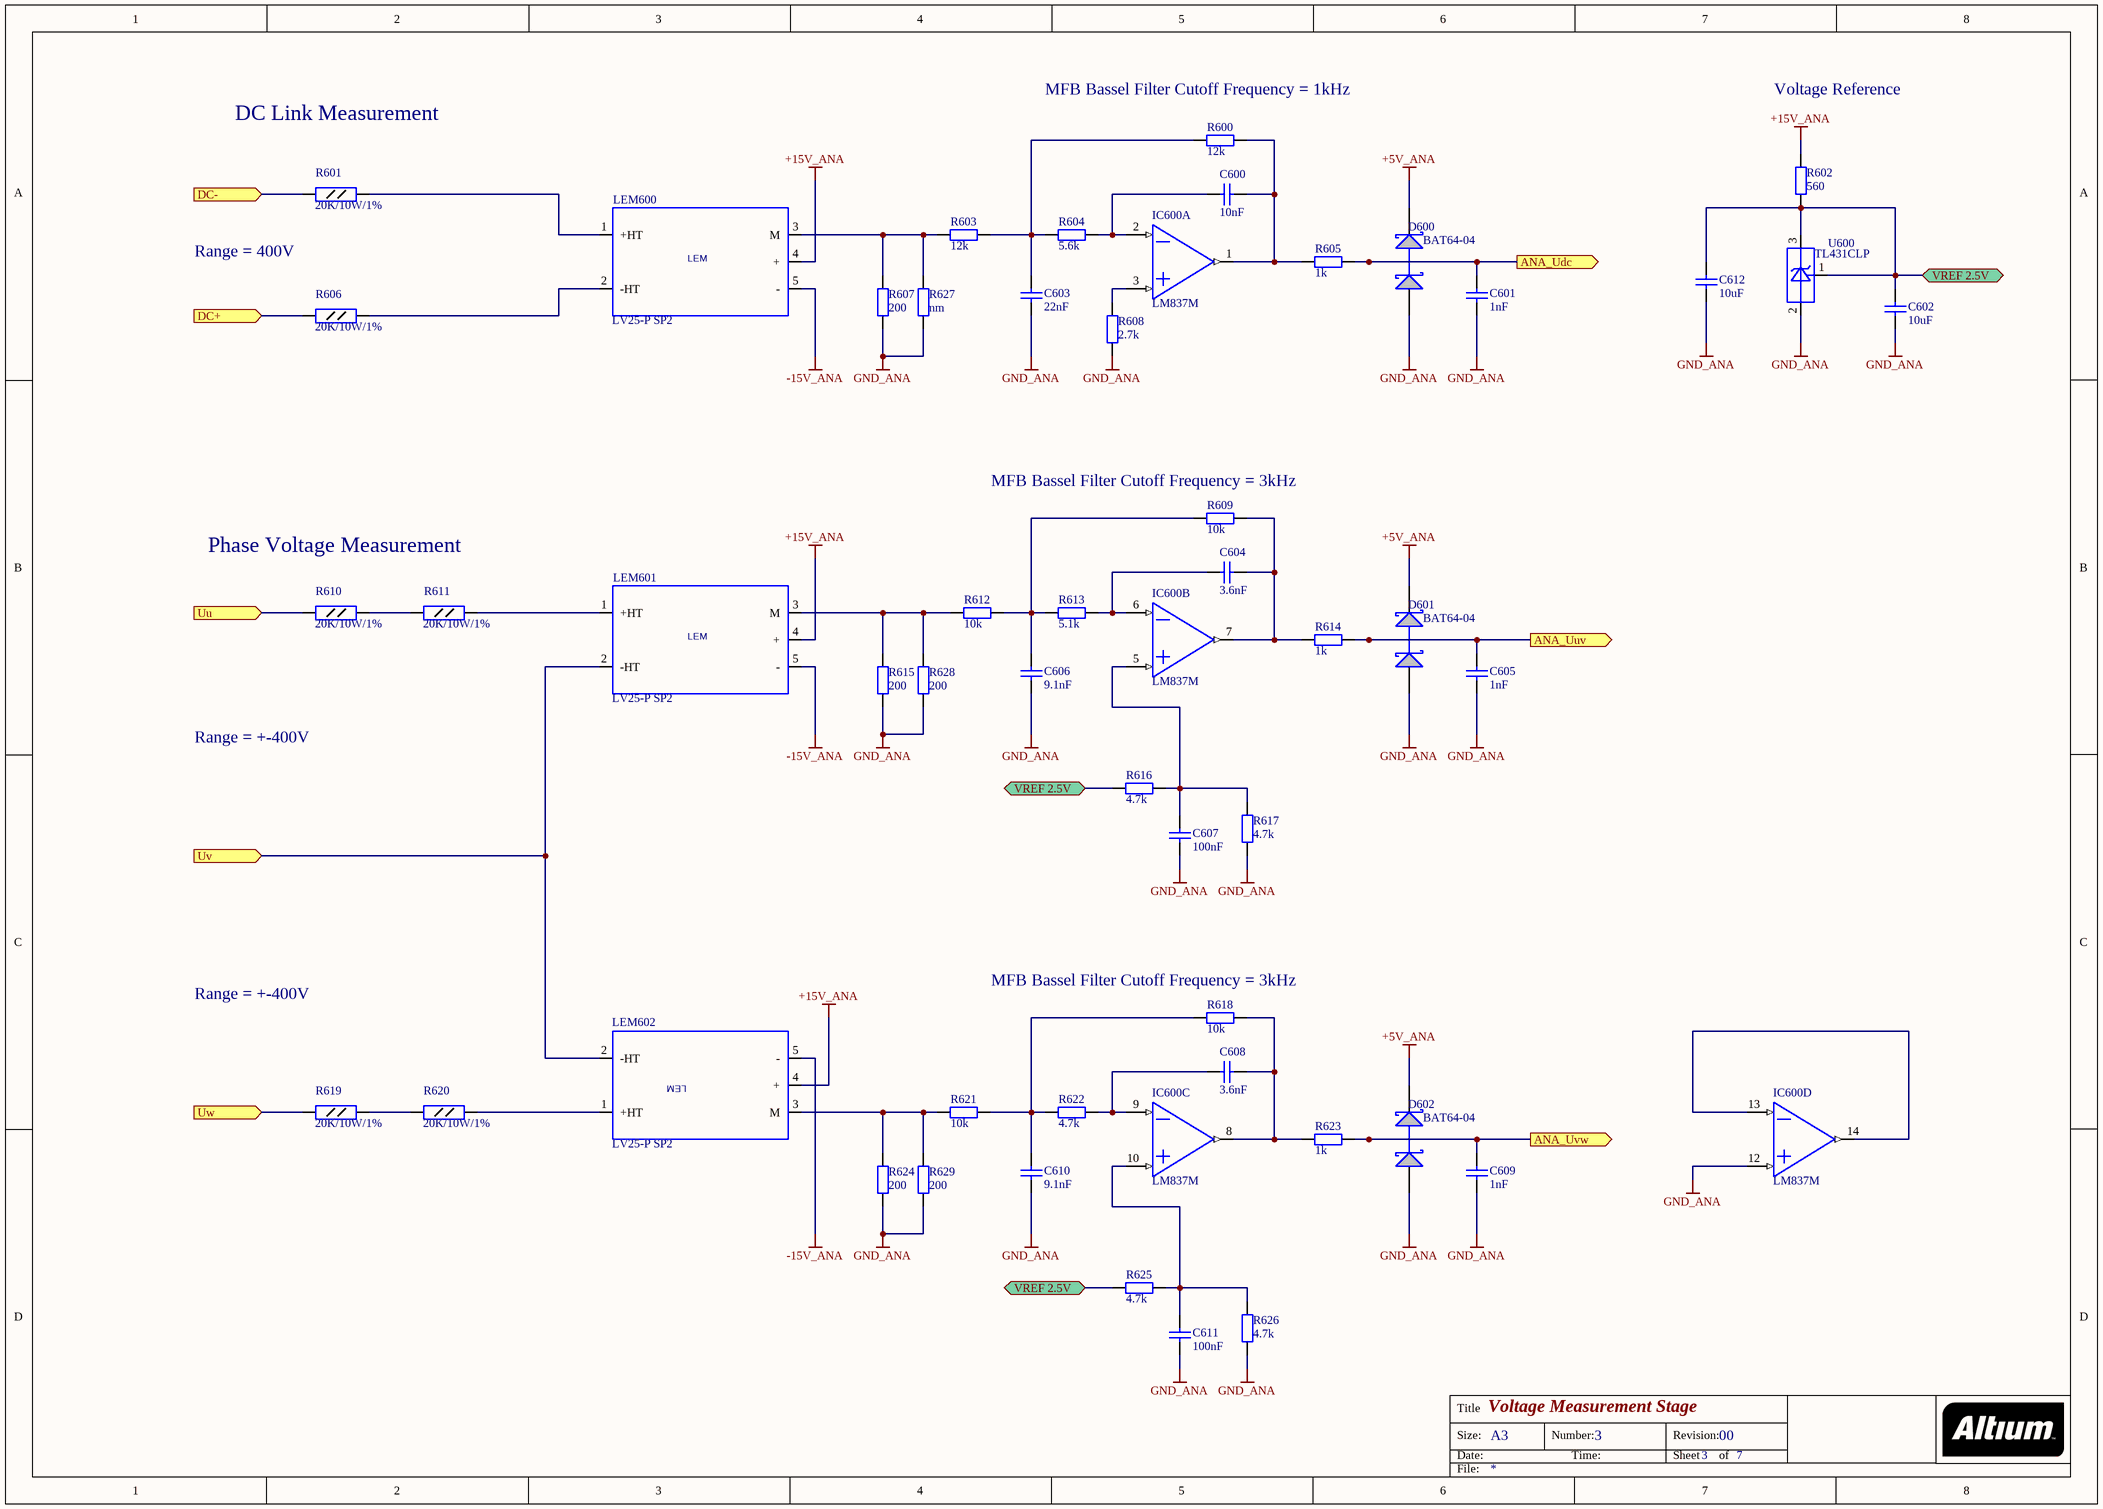
[diagram p4: Voltage Measurement Stage.SchDoc]

### Parts
C600  value 10nF  [1206_REFLOW]  (hidden comment: Cap 1206)
C601  value 1nF  [1206_REFLOW]  (hidden comment: Cap 1206)
C602  value 10uF  [1206_REFLOW]  (hidden comment: Cap 1206)
C603  value 22nF  [1206_REFLOW]  (hidden comment: Cap 1206)
C604  value 3.6nF  [1206_REFLOW]  (hidden comment: Cap 1206)
C605  value 1nF  [1206_REFLOW]  (hidden comment: Cap 1206)
C606  value 9.1nF  [1206_REFLOW]  (hidden comment: Cap 1206)
C607  value 100nF  [1206_REFLOW]  (hidden comment: Cap 1206)
C608  value 3.6nF  [1206_REFLOW]  (hidden comment: Cap 1206)
C609  value 1nF  [1206_REFLOW]  (hidden comment: Cap 1206)
C610  value 9.1nF  [1206_REFLOW]  (hidden comment: Cap 1206)
C611  value 100nF  [1206_REFLOW]  (hidden comment: Cap 1206)
C612  value 10uF  [1206_REFLOW]  (hidden comment: Cap 1206)
D600  BAT64-04  [SOT23_HIS_Primary]
D601  BAT64-04  [SOT23_HIS_Primary]
D602  BAT64-04  [SOT23_HIS_Primary]
IC600  value LM837M  [SO14]  (hidden comment: LM837)  (parts A,B,C,D of 4)
LEM600  value LV25-P SP2  [LV25]  (hidden comment: LEM)
LEM601  value LV25-P SP2  [LV25]  (hidden comment: LEM)
LEM602  value LV25-P SP2  [LV25]  (hidden comment: LEM)
R600  value 12k  [1206_REFLOW]  (hidden comment: RES)
R601  value 20K/10W/1%  [RES 10W]  (hidden comment: RES 10W)
R602  value 560  [1206_REFLOW]  (hidden comment: RES)
R603  value 12k  [1206_REFLOW]  (hidden comment: RES)
R604  value 5.6k  [1206_REFLOW]  (hidden comment: RES)
R605  value 1k  [1206_REFLOW]  (hidden comment: RES)
R606  value 20K/10W/1%  [RES 10W]  (hidden comment: RES 10W)
R607  value 200  [1206_REFLOW]  (hidden comment: RES)
R608  value 2.7k  [1206_REFLOW]  (hidden comment: RES)
R609  value 10k  [1206_REFLOW]  (hidden comment: RES)
R610  value 20K/10W/1%  [RES 10W]  (hidden comment: RES 10W)
R611  value 20K/10W/1%  [RES 10W]  (hidden comment: RES 10W)
R612  value 10k  [1206_REFLOW]  (hidden comment: RES)
R613  value 5.1k  [1206_REFLOW]  (hidden comment: RES)
R614  value 1k  [1206_REFLOW]  (hidden comment: RES)
R615  value 200  [1206_REFLOW]  (hidden comment: RES)
R616  value 4.7k  [1206_REFLOW]  (hidden comment: RES)
R617  value 4.7k  [1206_REFLOW]  (hidden comment: RES)
R618  value 10k  [1206_REFLOW]  (hidden comment: RES)
R619  value 20K/10W/1%  [RES 10W]  (hidden comment: RES 10W)
R620  value 20K/10W/1%  [RES 10W]  (hidden comment: RES 10W)
R621  value 10k  [1206_REFLOW]  (hidden comment: RES)
R622  value 4.7k  [1206_REFLOW]  (hidden comment: RES)
R623  value 1k  [1206_REFLOW]  (hidden comment: RES)
R624  value 200  [1206_REFLOW]  (hidden comment: RES)
R625  value 4.7k  [1206_REFLOW]  (hidden comment: RES)
R626  value 4.7k  [1206_REFLOW]  (hidden comment: RES)
R627  value nm  [1206_REFLOW]  (hidden comment: RES)
R628  value 200  [1206_REFLOW]  (hidden comment: RES)
R629  value 200  [1206_REFLOW]  (hidden comment: RES)
U600  TL431CLP  [TO-92 - TL431]

### Ports
ANA_Udc (out), ANA_Uuv (out), ANA_Uvw (out), DC+ (in), DC- (in), Uu (in), Uv (in), Uw (in), VREF 2.5V (bidir)

### Nets
+5V_ANA: D600.2(K) D601.2(K) D602.2(K)
+15V_ANA: IC600.4(VCC) LEM600.4(+) LEM601.4(+) LEM602.4(+) R602.2
-15V_ANA: IC600.11(VEE) LEM600.5(-) LEM601.5(-) LEM602.5(-)
GND_ANA: C601.1 C602.1 C603.1 C605.1 C606.1 C607.1 C609.1 C610.1 C611.1 C612.1 D600.1(A) D601.1(A) D602.1(A) IC600.12(+IN4) R607.2 R608.2 R615.2 R617.1 R624.2 R626.1 R627.2 R628.2 R629.2 U600.2(ANODE)
NetC408_2: R606.2 ; port DC+
NetC435_2: R619.2 ; port Uw
NetC436_2: LEM601.2(-HT) LEM602.2(-HT) ; port Uv
NetC437_2: R610.2 ; port Uu
NetC600_1: C600.1 IC600.2(-IN1) R604.2
NetC600_2: C600.2 IC600.1(OUT1) R600.2 R605.1
NetC601_2: C601.2 D600.3(C) R605.2 ; port ANA_Udc
NetC602_2: C602.2 C612.2 R602.1 R616.1 R625.1 U600.1(REF) U600.3(CATHODE) ; port VREF 2.5V
NetC603_2: C603.2 R600.1 R603.2 R604.1
NetC604_1: C604.1 IC600.6(-IN2) R613.2
NetC604_2: C604.2 IC600.7(OUT2) R609.2 R614.1
NetC605_2: C605.2 D601.3(C) R614.2 ; port ANA_Uuv
NetC606_2: C606.2 R609.1 R612.2 R613.1
NetC607_2: C607.2 IC600.5(+IN2) R616.2 R617.2
NetC608_1: C608.1 IC600.9(-IN3) R622.2
NetC608_2: C608.2 IC600.8(OUT3) R618.2 R623.1
NetC609_2: C609.2 D602.3(C) R623.2 ; port ANA_Uvw
NetC610_2: C610.2 R618.1 R621.2 R622.1
NetC611_2: C611.2 IC600.10(+IN3) R625.2 R626.2
NetC700_2: R601.2 ; port DC-
NetIC600_3: IC600.3(+IN1) R608.1
NetIC600_13: IC600.13(-IN4) IC600.14(OUT4)
NetLEM600_1: LEM600.1(+HT) R601.1
NetLEM600_2: LEM600.2(-HT) R606.1
NetLEM600_3: LEM600.3(M) R603.1 R607.1 R627.1
NetLEM601_1: LEM601.1(+HT) R611.1
NetLEM601_3: LEM601.3(M) R612.1 R615.1 R628.1
NetLEM602_1: LEM602.1(+HT) R620.1
NetLEM602_3: LEM602.3(M) R621.1 R624.1 R629.1
NetR610_1: R610.1 R611.2
NetR619_1: R619.1 R620.2

### Notes on the sheet
- (near R600) MFB Bassel Filter Cutoff Frequency = 1kHz
- Voltage Reference
- DC Link Measurement
- Range = 400V
- (near R609) MFB Bassel Filter Cutoff Frequency = 3kHz
- Phase Voltage Measurement
- Range = +-400V
- (near R618) MFB Bassel Filter Cutoff Frequency = 3kHz
- Title
- Size:
- Date:
- A3
- Number:
- Time:
- Revision:
- Sheet
- of
- File:

### Library data of the parts
D600-D602 = BAT64-04: Silicon Schottky Diodes; Manufacturer: INF; ComponentLink1DescBC: Manufacturer Link; Group: Discrete; Subgroup: Diode; Published: 21-Mar-2003; DatasheetDocument: Oct-1999; PackageDocument: Sep-2001; PackageReference: SOT-23; Publisher: Altium Limited; ComponentLink1URL: http://www.infineon.com/; Value: BAT64-04
IC600 = LM837: Manufacturer: National Semiconductor; Description: Quad Low Noise OpAmp
LEM600-LEM602 = LEM: LV25-P
R600 R602-R605 R607-R609 R612-R618 R621-R629 = RES 1
U600 = TL431CLP: Manufacturer 1: Texas Instruments; PN: 01010112-0041-0000; Group: Power-management ICs; Detail: Adjustable Shunt Regulator; Order Code 1: TL431CLP MBR; OriginalName: LM336BZ; Description: 2.5V Voltage Reference; ComponentField7: Published 24-Aug-2001; Case: TO-92; Mfr 1 PN: TL431CLP; CreateDate: 06/06/2008 17:02:07; ModifyDate: 02/26/2009 17:21:37; Supplier 1: Comet; Price 1: 0.08 ˆ; Value: TL431CLP

## Sheet Communication.SchDoc: USB <-> RS232
size A4; Date: 28.08.2010; ApprovedBy: V.Gyurov; CheckedBy: V.Gyurov; Author: V.Gyurov; CompanyName: V.Gyurov; DrawnBy: V.Gyurov; Engineer: V.Gyurov; DocumentNumber: 6; Revision: 00; SheetNumber: 6; SheetTotal: 7; VersionControl_RevNumber: V1.00 R.00; CurrentDate: 28.08.2010; DocumentName: USB <-> RS232; ModifiedDate: 28.08.2010
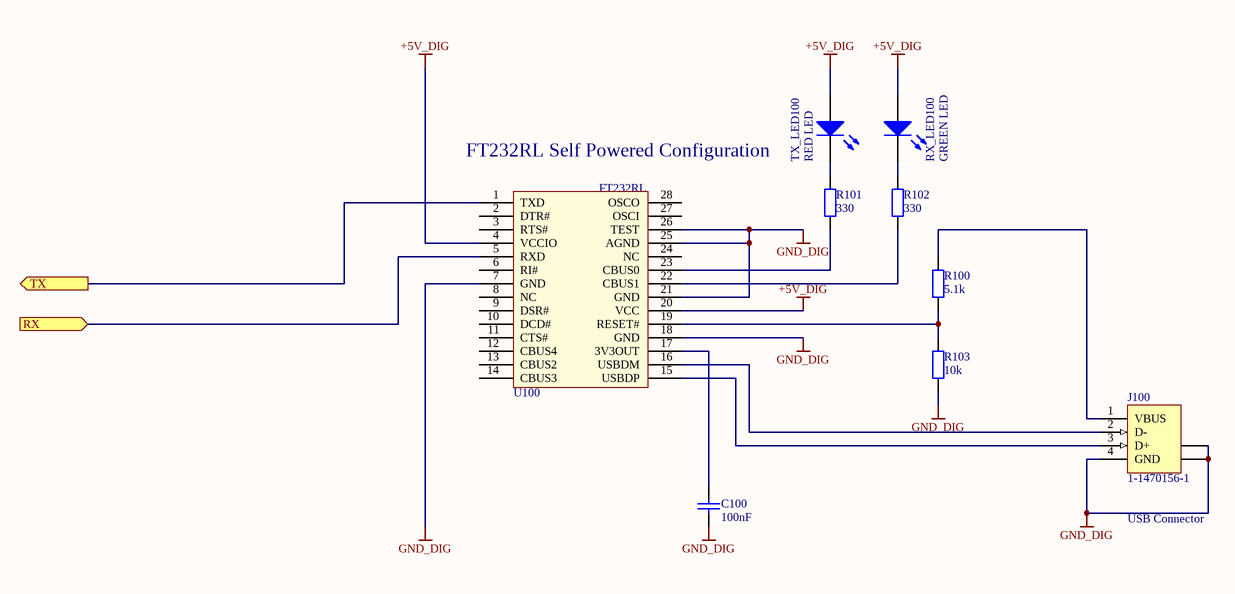
[diagram p5: Communication.SchDoc]

### Parts
C100  value 100nF  [3216[1206]]  (hidden comment: Cap)
J100  1-1470156-1  [USB2.5-2H4D]
R100  value 5.1k  [3216[1206]]  (hidden comment: Resistor)
R101  value 330  [3216[1206]]  (hidden comment: Resistor)
R102  value 330  [3216[1206]]  (hidden comment: Resistor)
R103  value 10k  [3216[1206]]  (hidden comment: Resistor)
RX_LED100  GREEN LED  [LED_1206]
TX_LED100  RED LED  [LED_1206]
U100  FT232RL  [SSOP28]

### Ports
RX (in), TX (out)

### Nets
+5V_DIG: RX_LED100.A TX_LED100.A U100.4(VCCIO) U100.20(VCC)
GND_DIG: C100.1 J100.4(GND) J100.5(SHLD) J100.6(SHLD) R103.1 U100.7(GND) U100.18(GND) U100.21(GND) U100.25(AGND) U100.26(TEST)
NetC100_2: C100.2 U100.17(3V3OUT)
NetJ100_1: J100.1(VBUS) R100.2
NetJ100_2: J100.2(D-) U100.16(USBDM)
NetJ100_3: J100.3(D+) U100.15(USBDP)
NetR100_1: R100.1 R103.2 U100.19(RESET#)
NetR101_1: R101.1 U100.23(CBUS0)
NetR101_2: R101.2 TX_LED100.K
NetR102_1: R102.1 U100.22(CBUS1)
NetR102_2: R102.2 RX_LED100.K
NetU100_1: U100.1(TXD) ; port TX
NetU100_5: U100.5(RXD) ; port RX

Not connected (* = marked no-connect by the designer): U100 2(DTR#) 3(RTS#) 6(RI#) 8(NC) 9(DSR#) 10(DCD#) 11(CTS#) 12(CBUS4) 13(CBUS2) 14(CBUS3) 24(NC) 27(OSCI) 28(OSCO)

### Notes on the sheet
- FT232RL Self Powered Configuration
- USB Connector
- Title
- Size:
- Date:
- A4
- Number:
- Time:
- Revision:
- Sheet
- of
- File:

### Library data of the parts
J100 = 1-1470156-1: USB 1.1, Right Angle, Thru-Hole, B Type, Receptacle, 4 Position, White; ContactMaterial: Phosphor Bronze; ContactPlating: Gold over Nickel; TerminationLength: 3.00mm [0.118in.]; PCB_Layout: Complies with manufacturer's recommendation.; DrillSize: Corresponds to nominal value.; PanelGround: Without; Published: 15-Jul-2004; DatasheetDocument: 02-Jun-2001; PackageDocument: 02-Jun-2001; PackageReference: 1-1470156; Publisher: Altium Limited; HousingMaterial: Glass-Filled Thermoplastic; ComponentLink1Description: Manufacturer Link; ComponentLink1URL: http://www.tycoelectronics.com/; ComponentLink2Description: Packaging Specification; ComponentLink2URL: http://ecommas.tycoelectronics.com/commerce/DocumentDelivery/DDEController?Action=showdoc&DocId=Customer+Drawing%7F1470156%7FO%7Ftif%7FEnglish%7FC_1470156_O.tif
R100-R103 = RES1
RX_LED100 TX_LED100 = LED: Value: TBD
U100 = FT232RL: Value: FT232RL

## Sheet Power Supply.SchDoc: Power Supply
size A4; Date: 28.08.2010; ApprovedBy: V.Gyurov; CheckedBy: V.Gyurov; Author: V.Gyurov; CompanyName: V.Gyurov; DrawnBy: V.Gyurov; Engineer: V.Gyurov; DocumentNumber: 4; Revision: 00; SheetNumber: 4; SheetTotal: 7; VersionControl_RevNumber: V1.00 R.00; CurrentDate: 28.08.2010; DocumentName: Power Supply
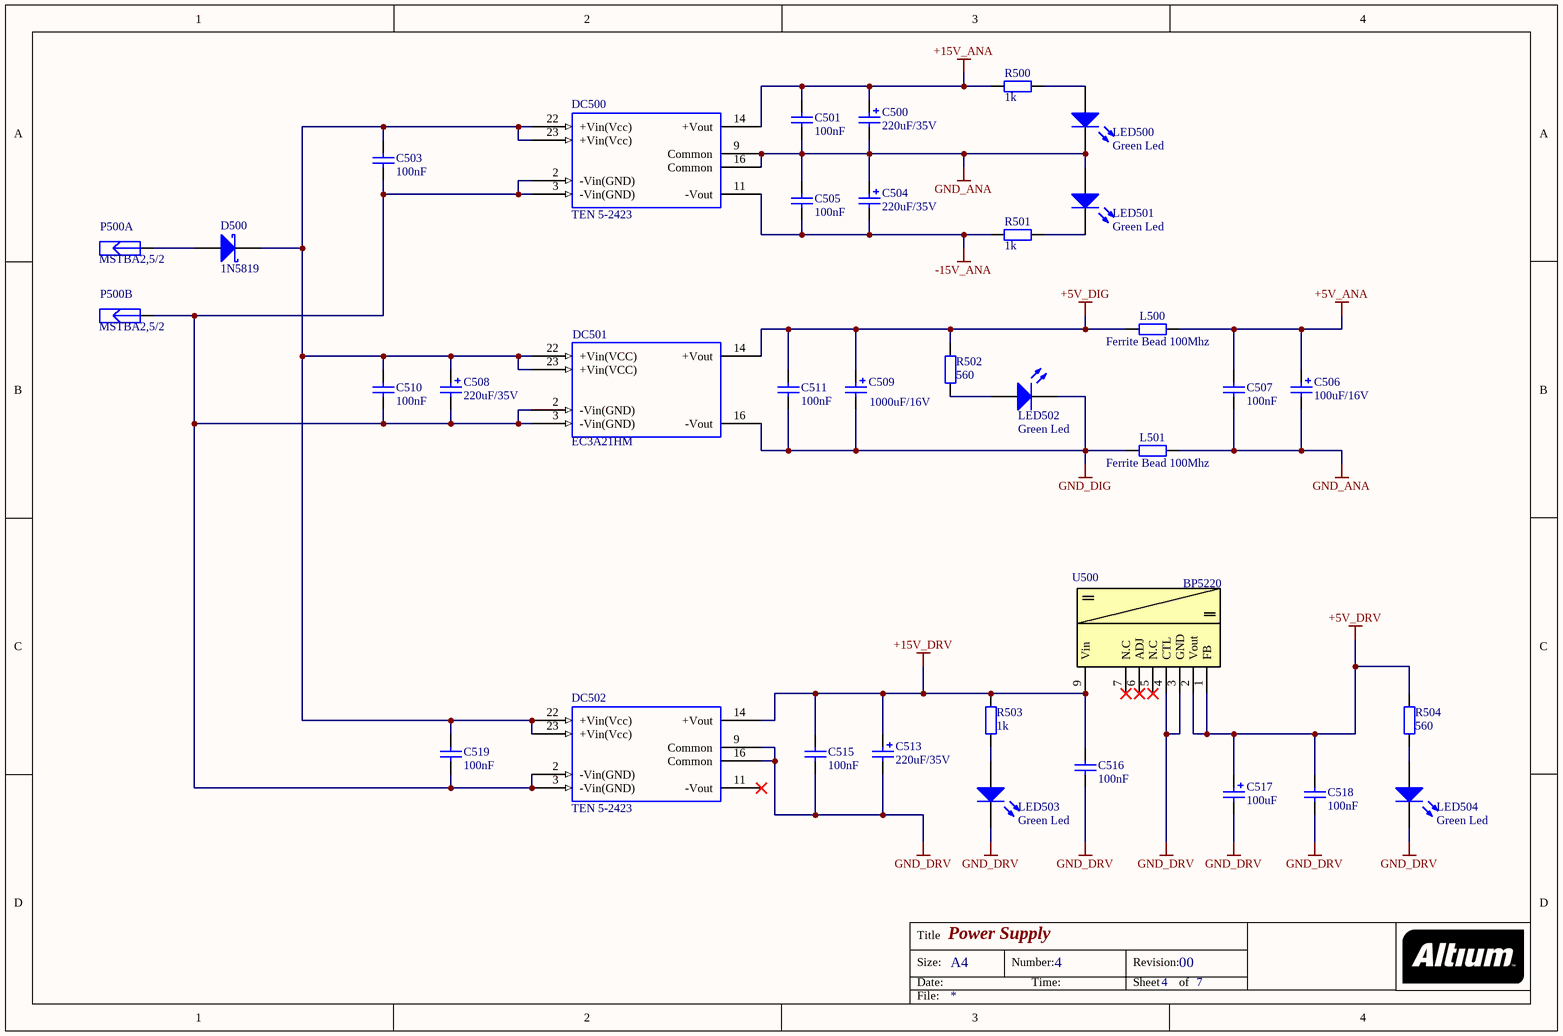
[diagram p6: Power Supply.SchDoc]

### Parts
C500  value 220uF/35V  [CAPPR3.5-8x12]  (hidden comment: Cap)
C501  value 100nF  [1206_REFLOW]  (hidden comment: Cap 1206)
C503  value 100nF  [1206_REFLOW]  (hidden comment: Cap 1206)
C504  value 220uF/35V  [CAPPR3.5-8x12]  (hidden comment: Cap)
C505  value 100nF  [1206_REFLOW]  (hidden comment: Cap 1206)
C506  value 100uF/16V  [CAPPR3.5-8x12]  (hidden comment: Cap)
C507  value 100nF  [1206_REFLOW]  (hidden comment: Cap 1206)
C508  value 220uF/35V  [CAPPR3.5-8x12]  (hidden comment: Cap)
C509  value 1000uF/16V  [CAPPR3.5-8x12]  (hidden comment: Cap)
C510  value 100nF  [1206_REFLOW]  (hidden comment: Cap 1206)
C511  value 100nF  [1206_REFLOW]  (hidden comment: Cap 1206)
C513  value 220uF/35V  [CAPPR3.5-8x12]  (hidden comment: Cap)
C515  value 100nF  [1206_REFLOW]  (hidden comment: Cap 1206)
C516  value 100nF  [1206_REFLOW]  (hidden comment: Cap 1206)
C517  value 100uF  [CAPPR3.5-8x12]  (hidden comment: Cap)
C518  value 100nF  [1206_REFLOW]  (hidden comment: Cap 1206)
C519  value 100nF  [1206_REFLOW]  (hidden comment: Cap 1206)
D500  1N5819  [DO-214_S1A(Primary)]
DC500  TEN 5-2423  [DIP24_TRACO]
DC501  EC3A21HM  [DIP24_TRACO]
DC502  TEN 5-2423  [DIP24_TRACO]
L500  value Ferrite Bead 100Mhz  [3216[1206]]  (hidden comment: RES)
L501  value Ferrite Bead 100Mhz  [3216[1206]]  (hidden comment: RES)
LED500  Green Led  [LED_1206]
LED501  Green Led  [LED_1206]
LED502  Green Led  [LED_1206]
LED503  Green Led  [LED_1206]
LED504  Green Led  [LED_1206]
P500  value MSTBA2,5/2  [MSTB2.5/2-G-5.08]  (hidden comment: MSTBA 2,5/ 2-G-5,08)  (parts A,B of 2)
R500  value 1k  [1206_REFLOW]  (hidden comment: RES)
R501  value 1k  [1206_REFLOW]  (hidden comment: RES)
R502  value 560  [1206_REFLOW]  (hidden comment: RES)
R503  value 1k  [1206_REFLOW]  (hidden comment: RES)
R504  value 560  [1206_REFLOW]  (hidden comment: RES)
U500  value BP5220  [BP5220]  (hidden comment: DC DC ROHM)

### Nets
+5V_ANA: C506.1 C507.2 L500.2
+5V_DIG: C509.1 C511.2 DC501.14(+Vout) L500.1 R502.1
+5V_DRV: C517.1 C518.2 R504.1 U500.1(FB) U500.2(Vout)
+15V_ANA: C500.1 C501.2 DC500.14(+Vout) R500.2
+15V_DRV: C513.1 C515.2 C516.2 DC502.14(+Vout) R503.1 U500.9(Vin)
-15V_ANA: C504.2 C505.1 DC500.11(-Vout) R501.2
GND_ANA: C500.2 C501.1 C504.1 C505.2 C506.2 C507.1 DC500.9(Common) DC500.16(Common) L501.2 LED500.K LED501.A
GND_DIG: C509.2 C511.1 DC501.16(-Vout) L501.1 LED502.K
GND_DRV: C513.2 C515.1 C516.1 C517.2 C518.1 DC502.9(Common) DC502.16(Common) LED503.K LED504.K U500.3(GND) U500.4(CTL)
NetC503_1: C503.1 C508.2 C510.1 C519.1 DC500.2(-Vin(GND)) DC500.3(-Vin(GND)) DC501.2(-Vin(GND)) DC501.3(-Vin(GND)) DC502.2(-Vin(GND)) DC502.3(-Vin(GND)) P500.2(SIG)
NetC503_2: C503.2 C508.1 C510.2 C519.2 D500.K DC500.22(+Vin(Vcc)) DC500.23(+Vin(Vcc)) DC501.22(+Vin(VCC)) DC501.23(+Vin(VCC)) DC502.22(+Vin(Vcc)) DC502.23(+Vin(Vcc))
NetD500_A: D500.A P500.1(SIG)
NetLED500_A: LED500.A R500.1
NetLED501_K: LED501.K R501.1
NetLED502_A: LED502.A R502.2
NetLED503_A: LED503.A R503.2
NetLED504_A: LED504.A R504.2

Not connected (* = marked no-connect by the designer): DC502 11(-Vout)*; U500 5(N.C)* 6(ADJ)* 7(N.C)*

### Notes on the sheet
- Title
- Size:
- Date:
- A4
- Number:
- Time:
- Revision:
- Sheet
- of
- File:

### Library data of the parts
C500 C504 C506 C508 C509 C513 C517 = Cap pol
DC501 = EC3A21HM: DC/DC CONVERTER, 3W 5V; Manufacturer: CINCON; Group: IC; Subgroup: Power Management; Subgroup1: DC-DC Converter; Supplier: Any; Order code: *; Package: DIL24; Mounting: TH; Mfrr. Part No.: EC3A21HM; Value: EC3A21HM
L500 L501 R500-R504 = RES 1
LED500-LED504 = LED: Value: TBD
P500 = MSTBA 2,5/ 2-G-5,08: Header, right angled, 12 A, 250 V, pitch 5.08 mm, No. of poles:2; Manufacturer: Phoenix; Mfrr. Part No.: 1757242; Group: Connector; Subgroup: Industrial; Supplier: Any; Mounting: TH; Package: TH; Order Code: *
U500 = BP5220
D500 = 1N5819: Value: 1N5819
DC500 DC502 = TEN 5-2423: Value: TEN 5-2423

## Nets that join several sheets
+5V_ANA: Power Stage (U400.8 U401.8 U402.8), Microcontroller Stage (C304.2 C305.2 U301.19), Voltage Measurement Stage (D600.2 D601.2 D602.2), Power Supply (C506.1 C507.2 L500.2)
+5V_DIG: Power Stage (5 pins), Microcontroller Stage (19 pins), Communication (RX_LED100.A TX_LED100.A U100.4 U100.20), Power Supply (5 pins)
+5V_DRV: Power Stage (22 pins), Power Supply (5 pins)
+15V_ANA: Voltage Measurement Stage (5 pins), Power Supply (C500.1 C501.2 DC500.14 R500.2)
+15V_DRV: Power Stage (10 pins), Power Supply (6 pins)
-15V_ANA: Voltage Measurement Stage (IC600.11 LEM600.5 LEM601.5 LEM602.5), Power Supply (C504.2 C505.1 DC500.11 R501.2)
GND_ANA: Power Stage (9 pins), Microcontroller Stage (C304.1 C305.1 U301.20), Voltage Measurement Stage (24 pins), Power Supply (11 pins)
GND_DIG: Power Stage (C419.1 C439.1 U403.5 U406.10), Microcontroller Stage (24 pins), Communication (10 pins), Power Supply (5 pins)
GND_DRV: Power Stage (44 pins), Power Supply (11 pins)
NetC401_2: Power Stage (C401.2 R400.2), Microcontroller Stage (U301.16)
NetC408_2: Power Stage (C408.2 C434.2 IPM400.22), Rectifier Stage (F701.2 P702.1 P702.2), Voltage Measurement Stage (R606.2)
NetC413_2: Power Stage (C413.2 R401.2), Microcontroller Stage (U301.15)
NetC421_2: Power Stage (C421.2 R414.2), Microcontroller Stage (U301.12)
NetC435_2: Power Stage (5 pins), Voltage Measurement Stage (R619.2)
NetC436_2: Power Stage (C436.2 IPM400.24 P401.1 P401.2), Voltage Measurement Stage (LEM601.2 LEM602.2)
NetC437_2: Power Stage (5 pins), Voltage Measurement Stage (R610.2)
NetC601_2: Microcontroller Stage (U301.13), Voltage Measurement Stage (C601.2 D600.3 R605.2)
NetC605_2: Microcontroller Stage (U301.11), Voltage Measurement Stage (C605.2 D601.3 R614.2)
NetC609_2: Microcontroller Stage (U301.14), Voltage Measurement Stage (C609.2 D602.3 R623.2)
NetC700_2: Power Stage (U402.3 U402.4), Rectifier Stage (7 pins), Voltage Measurement Stage (R601.2)
NetR303_2: Power Stage (R413.1 U403.6), Microcontroller Stage (R303.2 U300.10)
NetU100_1: Microcontroller Stage (U301.34), Communication (U100.1)
NetU100_5: Microcontroller Stage (U301.33), Communication (U100.5)
NetU300_3: Power Stage (U406.1 U406.19), Microcontroller Stage (U300.3)
NetU301_1: Power Stage (U406.6), Microcontroller Stage (U301.1)
NetU301_60: Power Stage (U406.3), Microcontroller Stage (U301.60)
NetU301_61: Power Stage (U406.2), Microcontroller Stage (U301.61)
NetU301_62: Power Stage (U406.5), Microcontroller Stage (U301.62)
NetU301_63: Power Stage (U406.4), Microcontroller Stage (U301.63)
NetU301_64: Power Stage (U406.7), Microcontroller Stage (U301.64)